# EAGLE schematic ActuatorBoard (EAGLE 9.6.2)

## Sheet 1 of 8
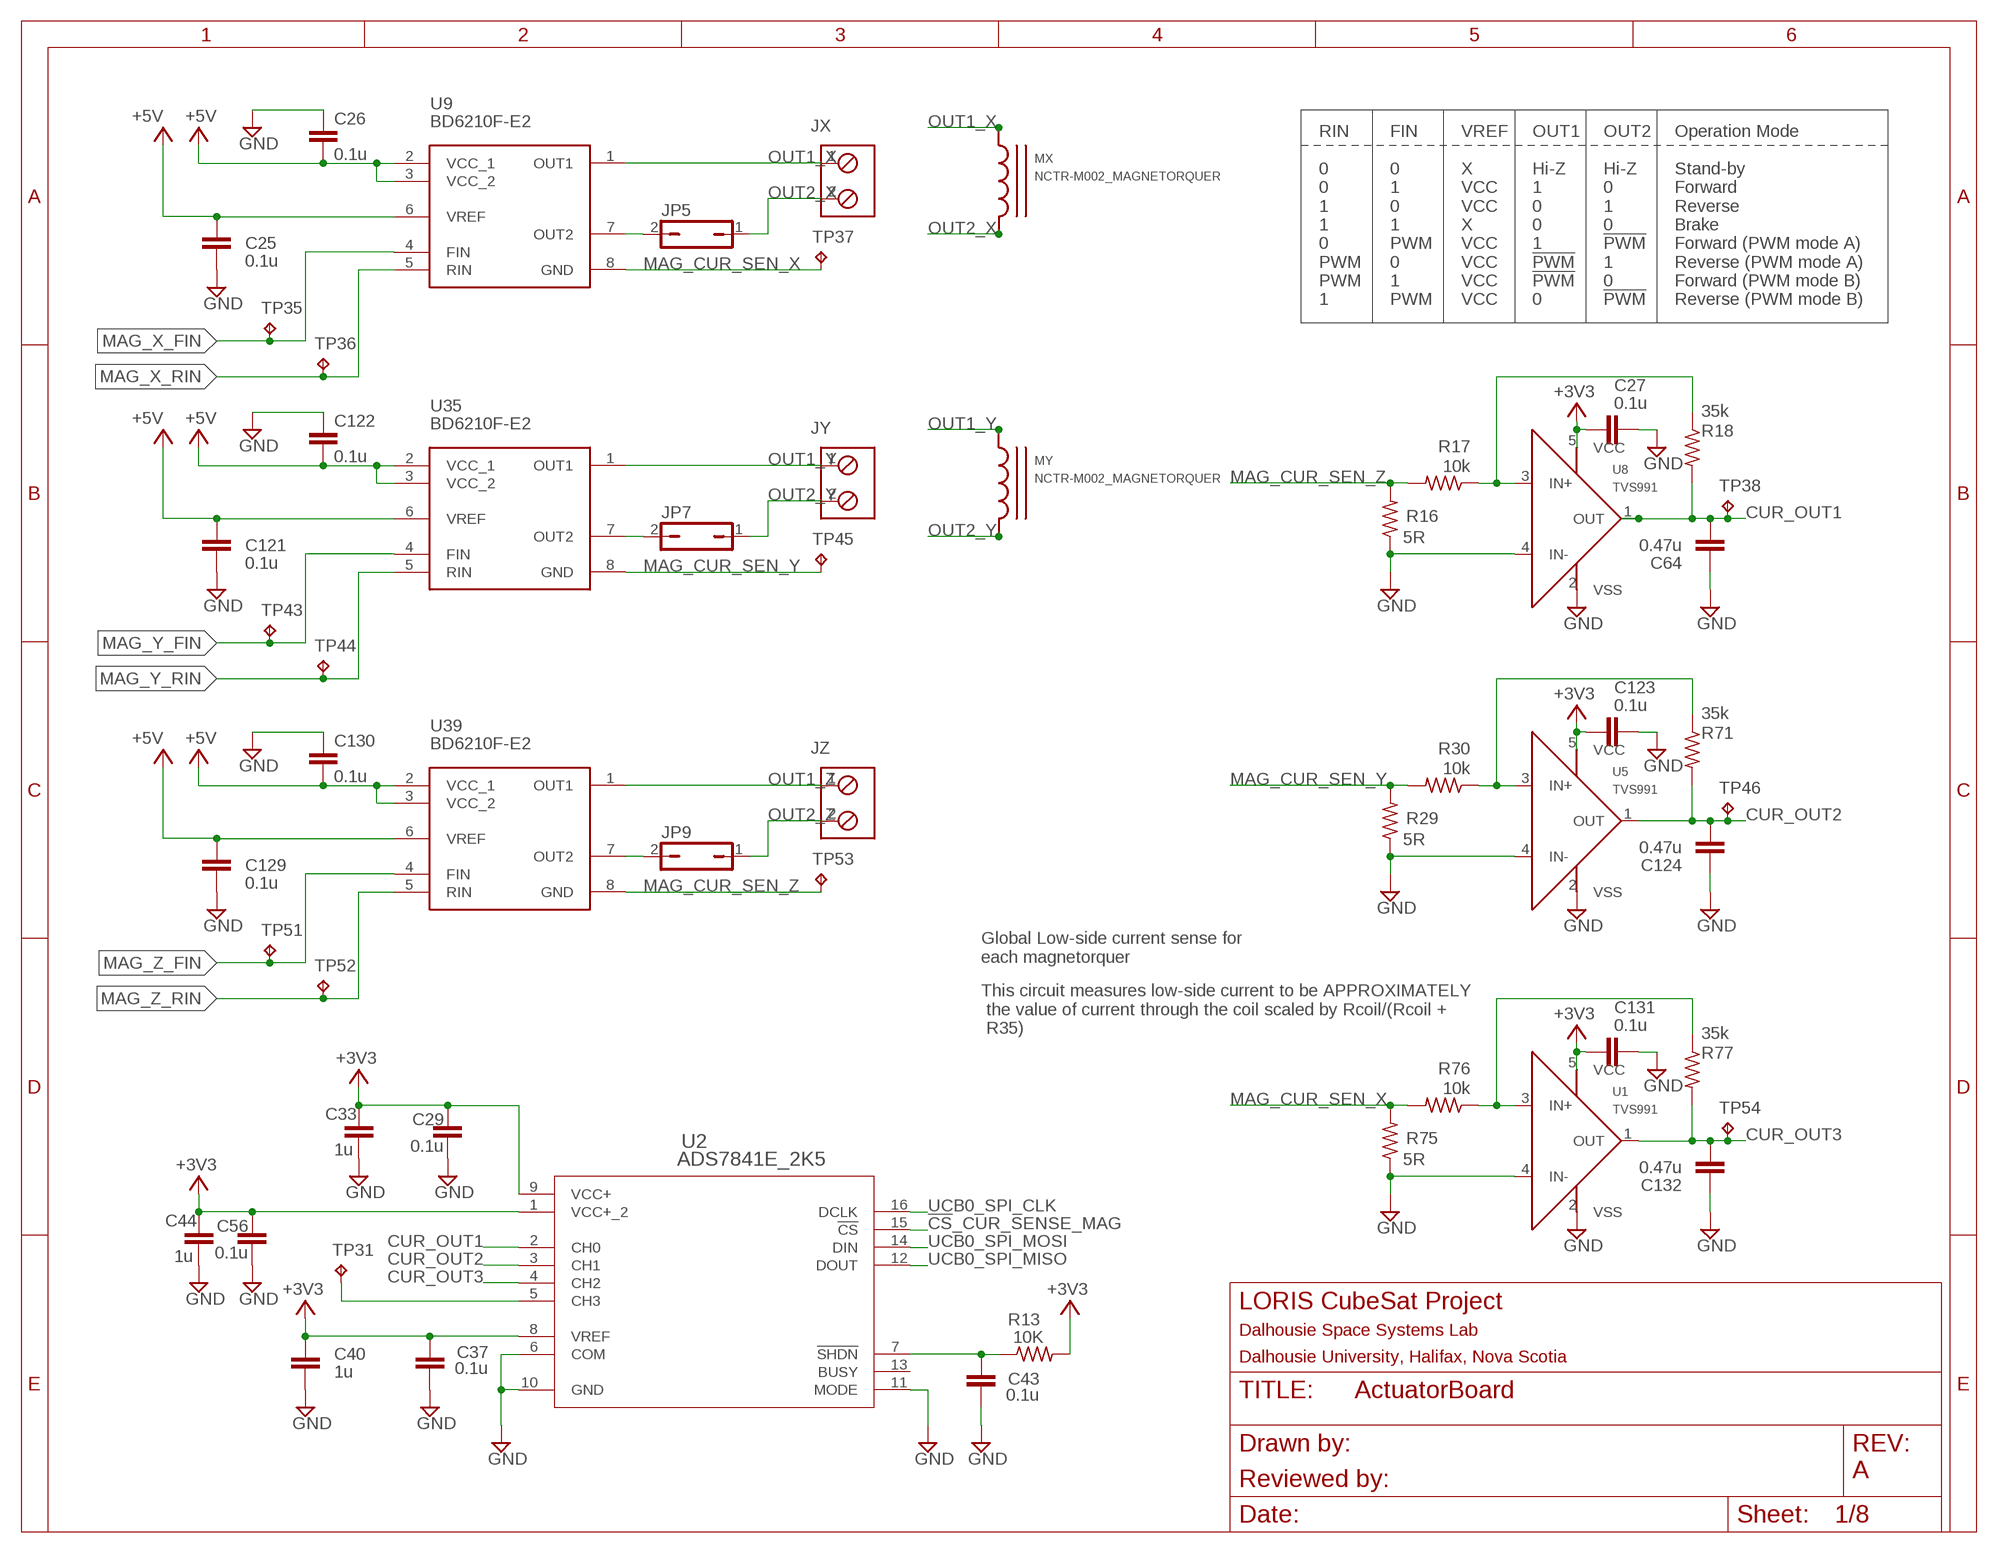
[diagram p0: schematic, sheet 1]

### Parts
C25  0.1u  C-EUC0603  [C0603]
C26  0.1u  C-EUC0603  [C0603]
C27  0.1u  C-EUC0402  [C0402]
C29  0.1u  C-EUC0402  [C0402]
C33  1u  C-EUC0402  [C0402]
C37  0.1u  C-EUC0402  [C0402]
C40  1u  C-EUC0402  [C0402]
C43  0.1u  C-EUC0402  [C0402]
C44  1u  C-EUC0402  [C0402]
C56  0.1u  C-EUC0402  [C0402]
C64  0.47u  C-EUC0603  [C0603]
C121  0.1u  C-EUC0603  [C0603]
C122  0.1u  C-EUC0603  [C0603]
C123  0.1u  C-EUC0402  [C0402]
C124  0.47u  C-EUC0603  [C0603]
C129  0.1u  C-EUC0603  [C0603]
C130  0.1u  C-EUC0603  [C0603]
C131  0.1u  C-EUC0402  [C0402]
C132  0.47u  C-EUC0603  [C0603]
JP5  JP1Q_  [1X02]
JP7  JP1Q_  [1X02]
JP9  JP1Q_  [1X02]
JX  TRM_BLK_1X2  [2POL254]
JY  TRM_BLK_1X2  [2POL254]
JZ  TRM_BLK_1X2  [2POL254]
MX  NCTR-M002_MAGNETORQUER  [MAG_MOUNT_V3]
MY  NCTR-M002_MAGNETORQUER  [MAG_MOUNT_V3]
R13  10K  R-US_R0402  [R0402]
R16  5R  R-US_R0402  [R0402]
R17  10k  R-US_R0402  [R0402]
R18  35k  R-US_R0402  [R0402]
R29  5R  R-US_R0402  [R0402]
R30  10k  R-US_R0402  [R0402]
R71  35k  R-US_R0402  [R0402]
R75  5R  R-US_R0402  [R0402]
R76  10k  R-US_R0402  [R0402]
R77  35k  R-US_R0402  [R0402]
TP31  TESTPOINT  [TP_P76H50]
TP35  TESTPOINT  [TP_P76H50]
TP36  TESTPOINT  [TP_P76H50]
TP37  TESTPOINT  [TP_P76H50]
TP38  TESTPOINT  [TP_P76H50]
TP43  TESTPOINT  [TP_P76H50]
TP44  TESTPOINT  [TP_P76H50]
TP45  TESTPOINT  [TP_P76H50]
TP46  TESTPOINT  [TP_P76H50]
TP51  TESTPOINT  [TP_P76H50]
TP52  TESTPOINT  [TP_P76H50]
TP53  TESTPOINT  [TP_P76H50]
TP54  TESTPOINT  [TP_P76H50]
U1  TVS991  [SOT95P280X145-5N]
U2  ADS7841E_2K5  [DBQ16]
U5  TVS991  [SOT95P280X145-5N]
U8  TVS991  [SOT95P280X145-5N]
U9  BD6210F-E2  [BD6221F-E2_SOIC8P127_500X620X171L30X42N]
U35  BD6210F-E2  [BD6221F-E2_SOIC8P127_500X620X171L30X42N]
U39  BD6210F-E2  [BD6221F-E2_SOIC8P127_500X620X171L30X42N]

### Nets
!CS!_CUR_SENSE_MAG: U2.15(!CS) ; also sheet 2
+3V3: C27.1 C29.1 C33.1 C37.1 C40.1 C44.1 C56.1 C123.1 C131.1 R13.2 U1.5(VCC) U2.1(VCC+_2) U2.8(VREF) U2.9(VCC+) U5.5(VCC) U8.5(VCC) ; also sheet 2,3,4,5,6,7,8
+5V: C25.1 C26.2 C121.1 C122.2 C129.1 C130.2 U9.2(VCC_1) U9.3(VCC_2) U9.6(VREF) U35.2(VCC_1) U35.3(VCC_2) U35.6(VREF) U39.2(VCC_1) U39.3(VCC_2) U39.6(VREF) ; also sheet 2,7,8
CUR_OUT1: C64.2 R18.2 TP38.1(TP) U2.2(CH0) U8.1(OUT)
CUR_OUT2: C124.2 R71.2 TP46.1(TP) U2.3(CH1) U5.1(OUT)
CUR_OUT3: C132.2 R77.2 TP54.1(TP) U1.1(OUT) U2.4(CH2)
GND: C25.2 C26.1 C27.2 C29.2 C33.2 C37.2 C40.2 C43.2 C44.2 C56.2 C64.1 C121.2 C122.1 C123.2 C124.1 C129.2 C130.1 C131.2 C132.1 R16.1 R29.1 R75.1 U1.2(VSS) U1.4(IN-) U2.6(COM) U2.10(GND) U2.11(MODE) U5.2(VSS) U5.4(IN-) U8.2(VSS) U8.4(IN-) ; also sheet 2,3,4,5,6,7,8
MAG_CUR_SEN_X: R75.2 R76.2 TP37.1(TP) U9.8(GND)
MAG_CUR_SEN_Y: R29.2 R30.2 TP45.1(TP) U35.8(GND)
MAG_CUR_SEN_Z: R16.2 R17.2 TP53.1(TP) U39.8(GND)
MAG_X_FIN: TP35.1(TP) U9.4(FIN) ; also sheet 2
MAG_X_RIN: TP36.1(TP) U9.5(RIN) ; also sheet 2
MAG_Y_FIN: TP43.1(TP) U35.4(FIN) ; also sheet 2
MAG_Y_RIN: TP44.1(TP) U35.5(RIN) ; also sheet 2
MAG_Z_FIN: TP51.1(TP) U39.4(FIN) ; also sheet 2
MAG_Z_RIN: TP52.1(TP) U39.5(RIN) ; also sheet 2
N$13: C43.1 R13.1 U2.7(!SHDN)
N$15: TP31.1(TP) U2.5(CH3)
N$16: JP5.2 U9.7(OUT2)
N$21: R17.1 R18.1 U8.3(IN+)
N$33: JP7.2 U35.7(OUT2)
N$48: R30.1 R71.1 U5.3(IN+)
N$67: JP9.2 U39.7(OUT2)
N$68: R76.1 R77.1 U1.3(IN+)
OUT1_X: JX.1 U9.1(OUT1)
OUT1_Y: JY.1 U35.1(OUT1)
OUT1_Z: JZ.1 U39.1(OUT1)
OUT2_X: JP5.1 JX.2
OUT2_Y: JP7.1 JY.2
OUT2_Z: JP9.1 JZ.2
UCB0_SPI_CLK: U2.16(DCLK) ; also sheet 2,3,4,5,6,7
UCB0_SPI_MISO: U2.12(DOUT) ; also sheet 2,3,4,5,6,7
UCB0_SPI_MOSI: U2.14(DIN) ; also sheet 2,3,4,5,6,7
Unconnected: U2.13(BUSY)

### Notes on the sheet
- RIN
  
  0
  0
  1
  1
  0
  PWM
  PWM
  1
- FIN
  
  0
  1
  0
  1
  PWM
  0
  1
  PWM
- VREF
  
  X
  VCC
  VCC
  X
  VCC
  VCC
  VCC
  VCC
- OUT1
  
  Hi-Z
  1
  0
  0
  1
  !PWM
  !PWM
  0
- OUT2
  
  Hi-Z
  0
  1
  0
  !PWM
  1
  0
  !PWM
- Operation Mode
  
  Stand-by
  Forward
  Reverse
  Brake
  Forward (PWM mode A)
  Reverse (PWM mode A)
  Forward (PWM mode B)
  Reverse (PWM mode B)
- Global Low-side current sense for
  each magnetorquer
- This circuit measures low-side current to be APPROXIMATELY
   the value of current through the coil scaled by Rcoil/(Rcoil +
   R35)
- A

## Sheet 2 of 8
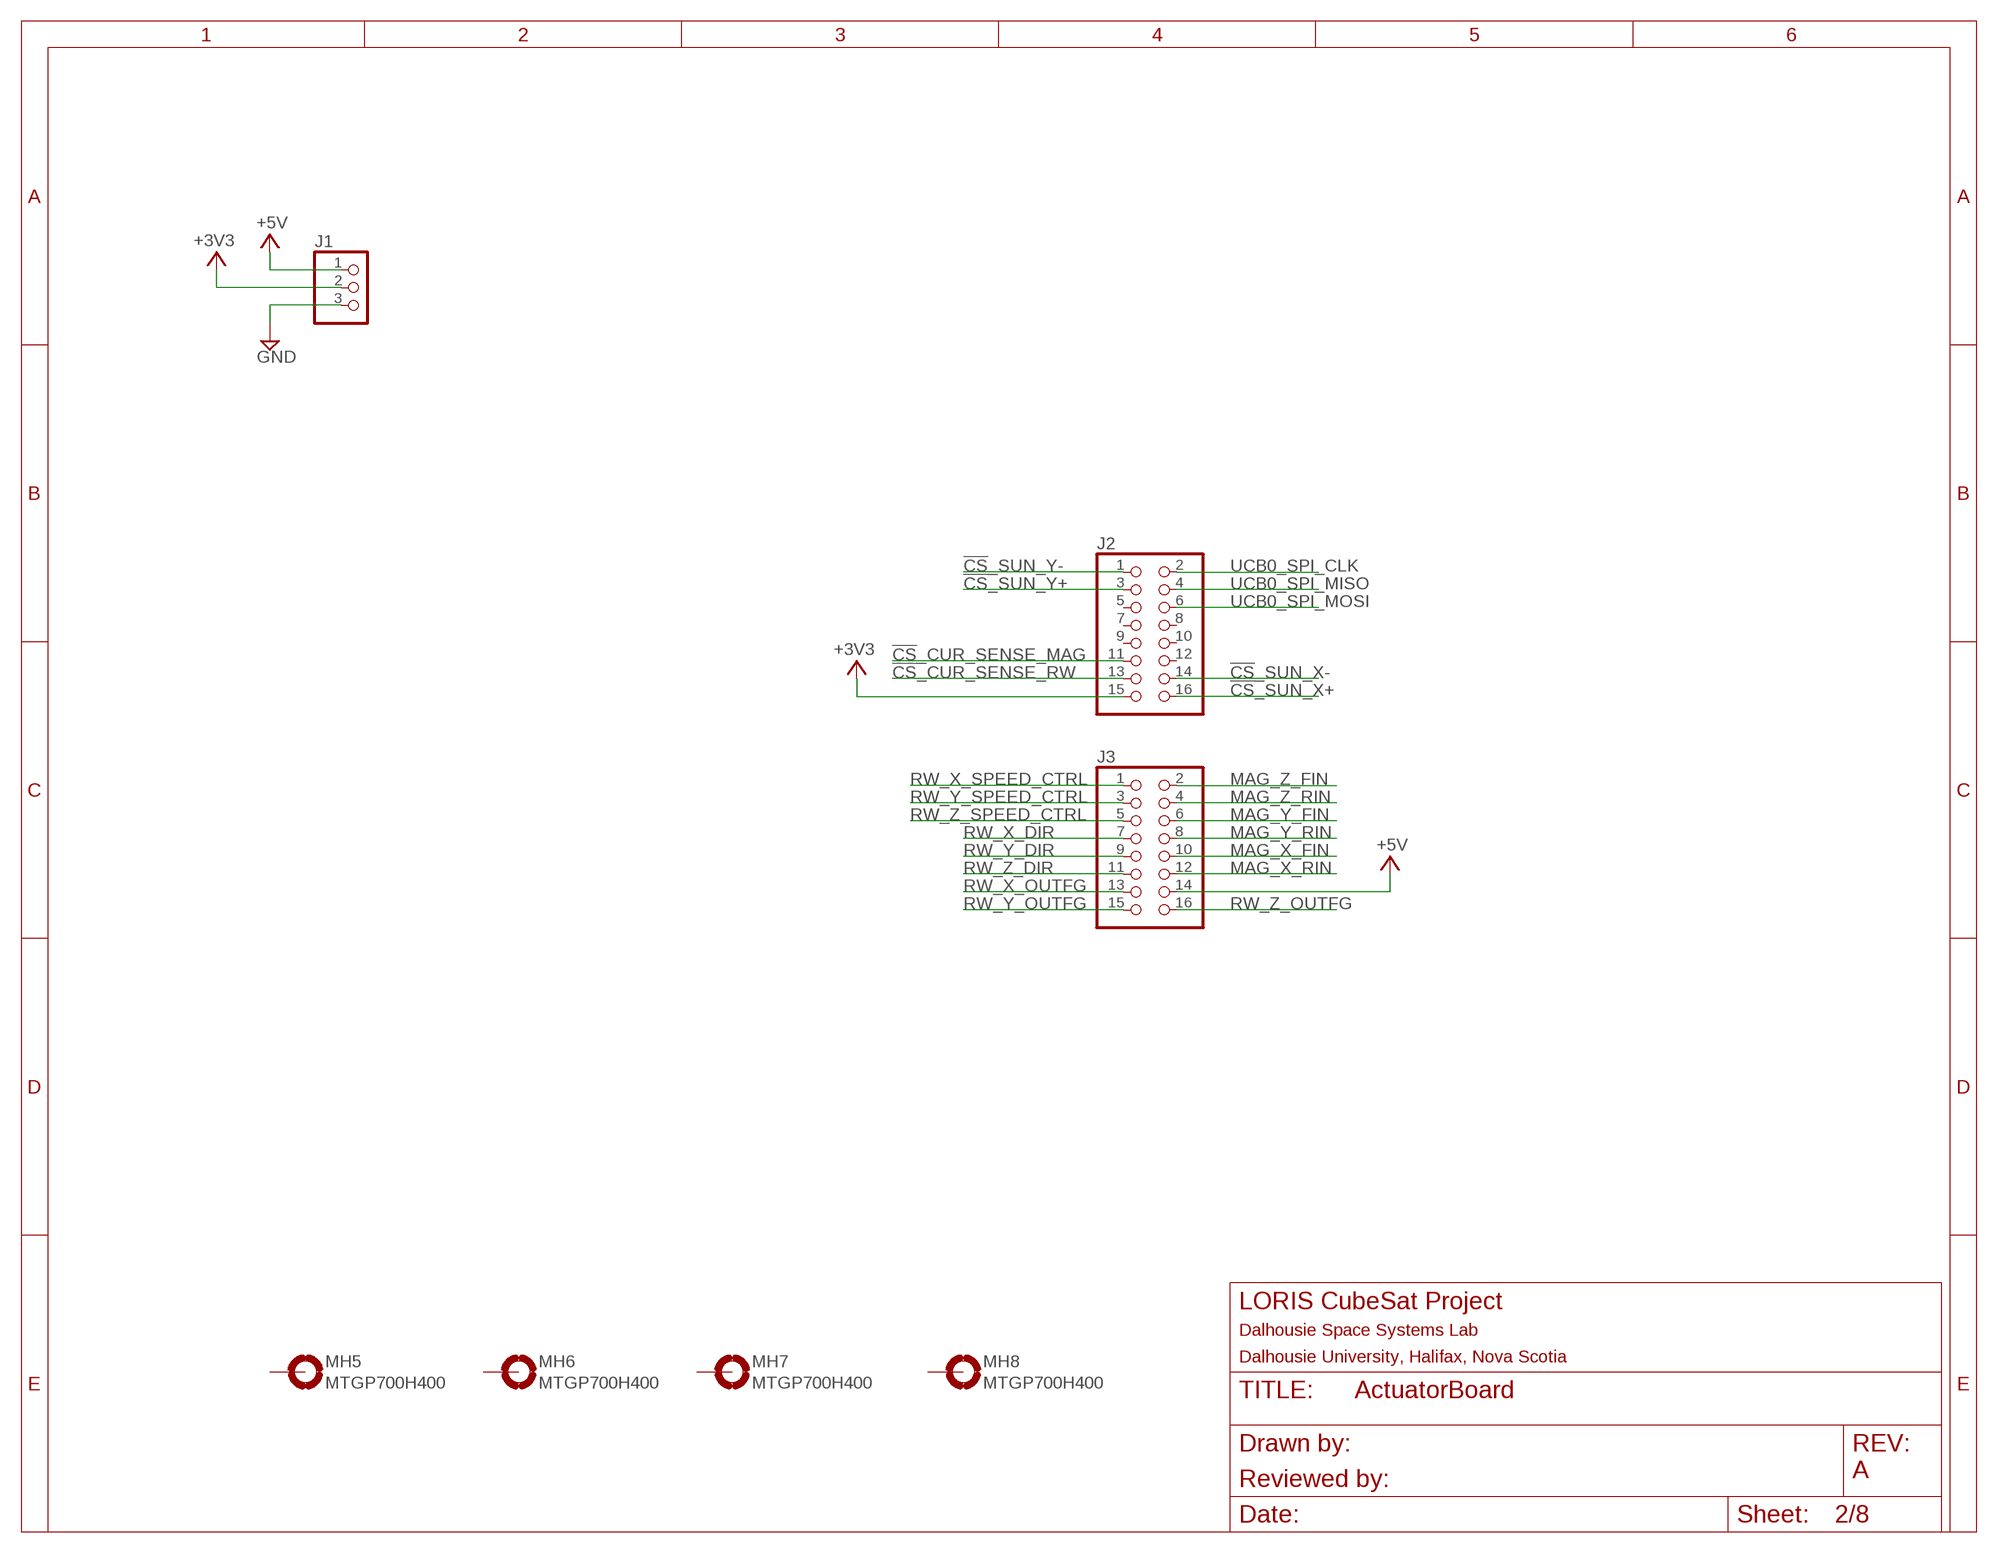
[diagram p1: schematic, sheet 2]

### Parts
J1  PINHD-1X3  [1X03]
J2  PINHD-2X8_TXT-MOVED  [2X08_TXT-MOVED]
J3  PINHD-2X8_TXT-MOVED  [2X08_TXT-MOVED]
MH5  MTGP700H400  [MTGP700H400]
MH6  MTGP700H400  [MTGP700H400]
MH7  MTGP700H400  [MTGP700H400]
MH8  MTGP700H400  [MTGP700H400]

### Nets
!CS!_CUR_SENSE_MAG: J2.11 ; also sheet 1
!CS!_CUR_SENSE_RW: J2.13 ; also sheet 7
!CS!_SUN_X+: J2.16 ; also sheet 3
!CS!_SUN_X-: J2.14 ; also sheet 4
!CS!_SUN_Y+: J2.3 ; also sheet 5
!CS!_SUN_Y-: J2.1 ; also sheet 6
+3V3: J1.2 J2.15 ; also sheet 1,3,4,5,6,7,8
+5V: J1.1 J3.14 ; also sheet 1,7,8
GND: J1.3 ; also sheet 1,3,4,5,6,7,8
MAG_X_FIN: J3.10 ; also sheet 1
MAG_X_RIN: J3.12 ; also sheet 1
MAG_Y_FIN: J3.6 ; also sheet 1
MAG_Y_RIN: J3.8 ; also sheet 1
MAG_Z_FIN: J3.2 ; also sheet 1
MAG_Z_RIN: J3.4 ; also sheet 1
RW_X_DIR: J3.7 ; also sheet 8
RW_X_OUTFG: J3.13 ; also sheet 8
RW_X_SPEED_CTRL: J3.1 ; also sheet 8
RW_Y_DIR: J3.9 ; also sheet 7
RW_Y_OUTFG: J3.15 ; also sheet 7
RW_Y_SPEED_CTRL: J3.3 ; also sheet 7
RW_Z_DIR: J3.11 ; also sheet 8
RW_Z_OUTFG: J3.16 ; also sheet 8
RW_Z_SPEED_CTRL: J3.5 ; also sheet 8
UCB0_SPI_CLK: J2.2 ; also sheet 1,3,4,5,6,7
UCB0_SPI_MISO: J2.4 ; also sheet 1,3,4,5,6,7
UCB0_SPI_MOSI: J2.6 ; also sheet 1,3,4,5,6,7
Unconnected: J2.5 J2.7 J2.8 J2.9 J2.10 J2.12 MH5.1(MOUNT) MH6.1(MOUNT) MH7.1(MOUNT) MH8.1(MOUNT)

### Notes on the sheet
- A

## Sheet 3 of 8
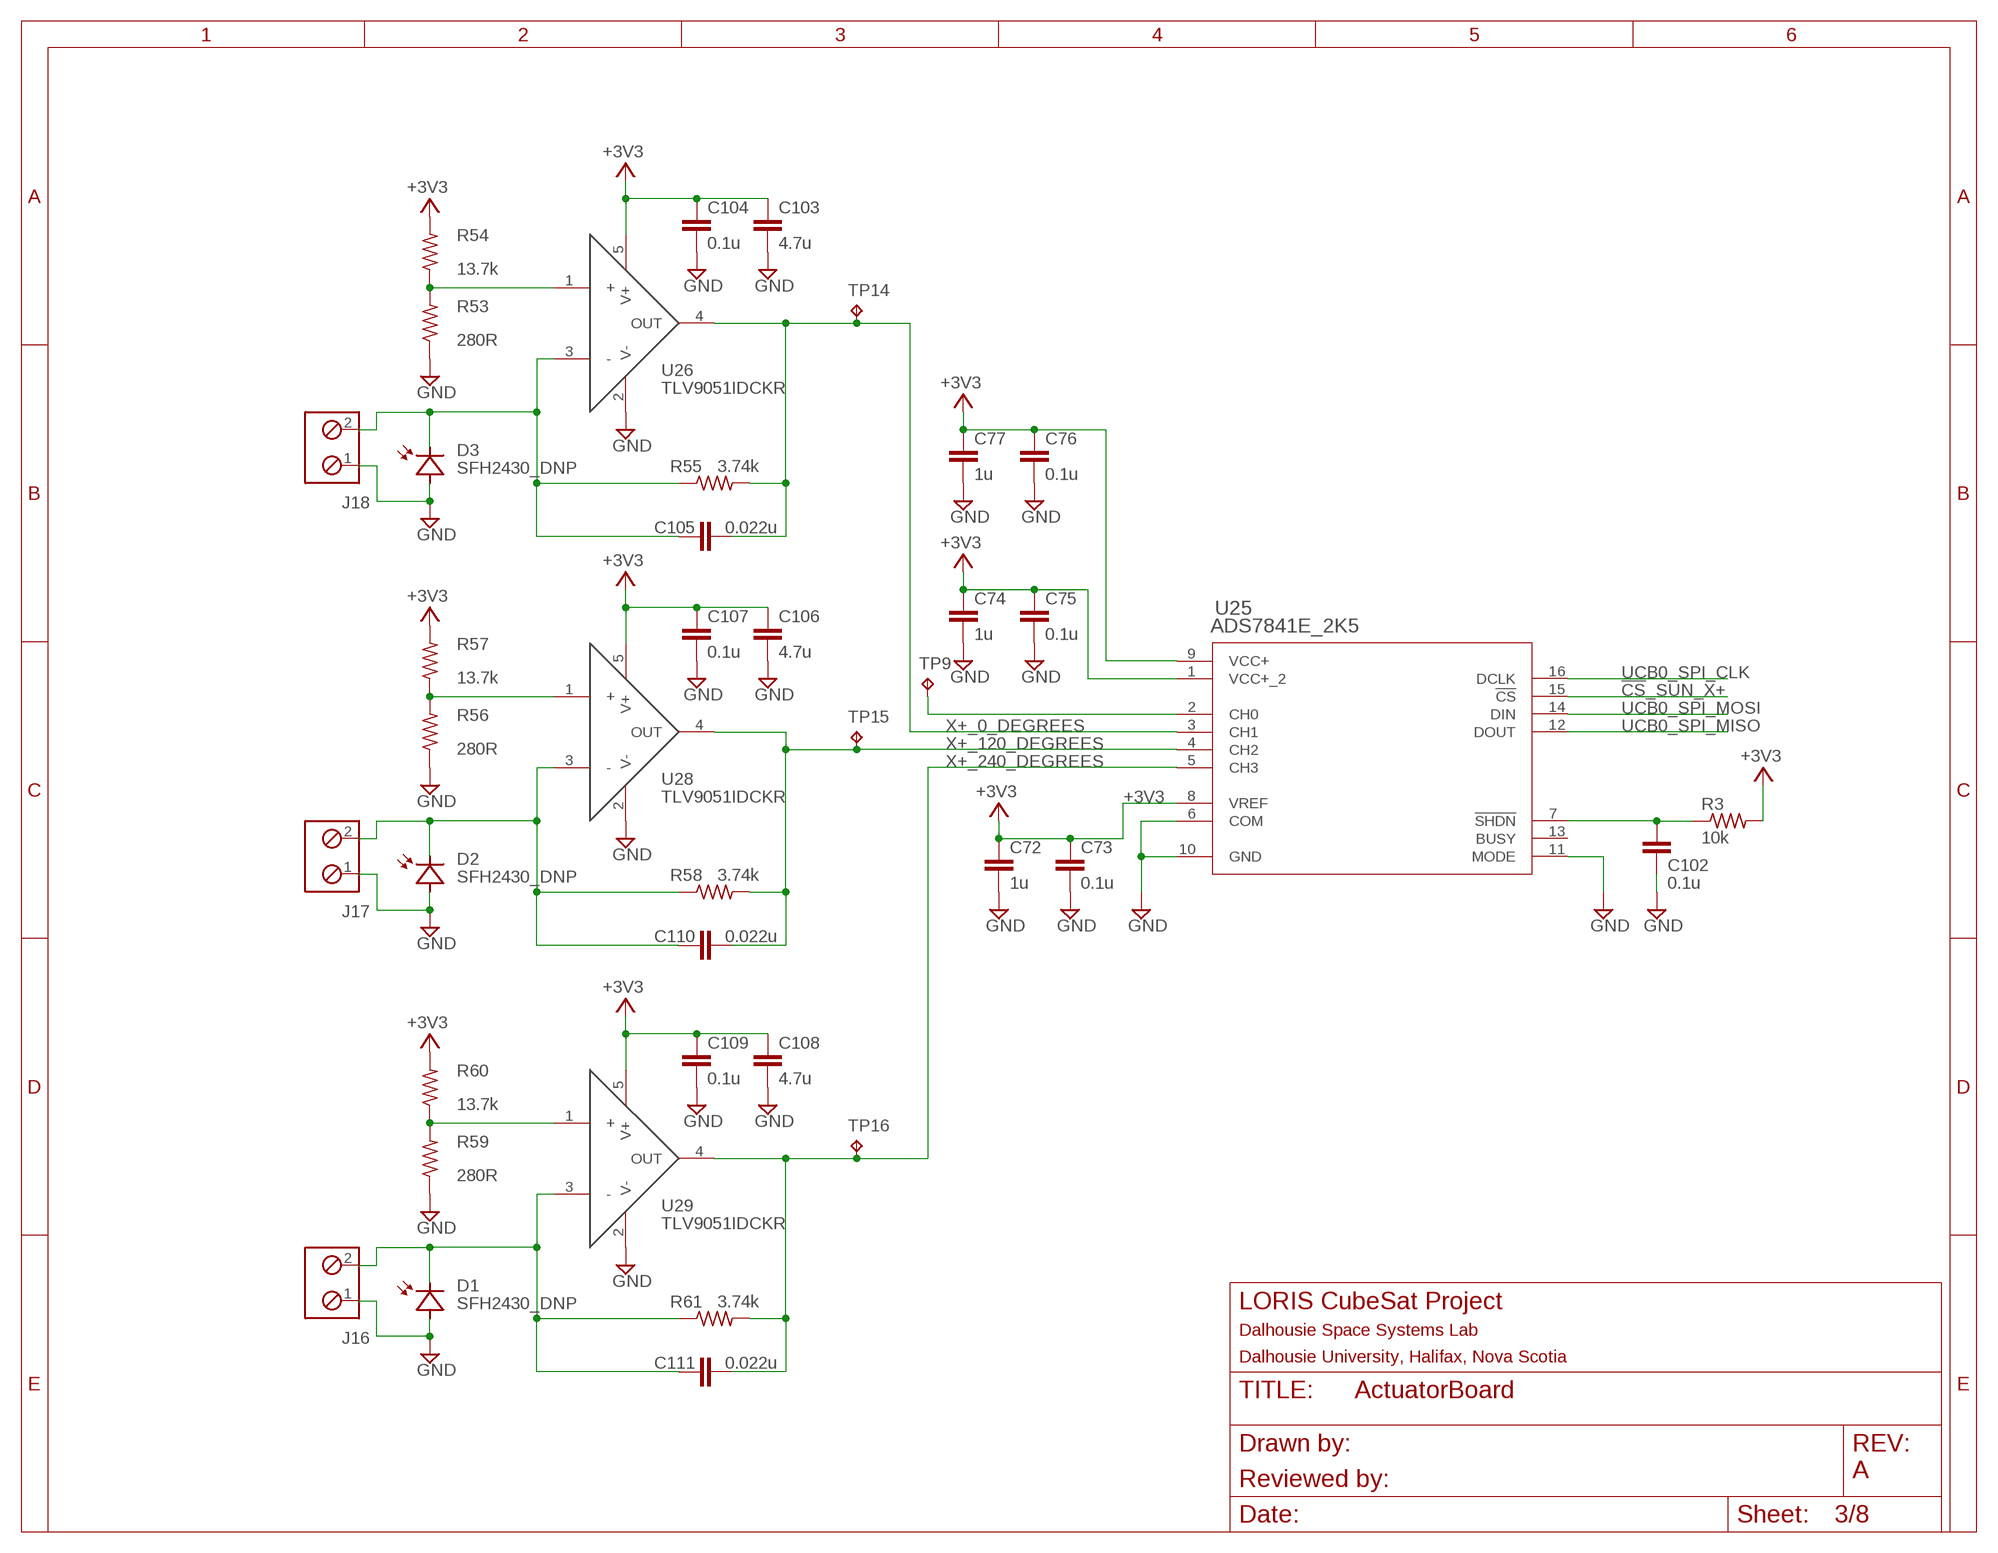
[diagram p2: schematic, sheet 3]

### Parts
C72  1u  C-EUC0402  [C0402]
C73  0.1u  C-EUC0402  [C0402]
C74  1u  C-EUC0402  [C0402]
C75  0.1u  C-EUC0402  [C0402]
C76  0.1u  C-EUC0402  [C0402]
C77  1u  C-EUC0402  [C0402]
C102  0.1u  C-EUC0402  [C0402]
C103  4.7u  C-EUC0402  [C0402]
C104  0.1u  C-EUC0402  [C0402]
C105  0.022u  C-EUC0402  [C0402]
C106  4.7u  C-EUC0402  [C0402]
C107  0.1u  C-EUC0402  [C0402]
C108  4.7u  C-EUC0402  [C0402]
C109  0.1u  C-EUC0402  [C0402]
C110  0.022u  C-EUC0402  [C0402]
C111  0.022u  C-EUC0402  [C0402]
J16  TRM_BLK_1X2  [2POL254]
J17  TRM_BLK_1X2  [2POL254]
J18  TRM_BLK_1X2  [2POL254]
R3  10k  R-US_R0402  [R0402]
R53  280R  R-US_R0402  [R0402]
R54  13.7k  R-US_R0402  [R0402]
R55  3.74k  R-US_R0402  [R0402]
R56  280R  R-US_R0402  [R0402]
R57  13.7k  R-US_R0402  [R0402]
R58  3.74k  R-US_R0402  [R0402]
R59  280R  R-US_R0402  [R0402]
R60  13.7k  R-US_R0402  [R0402]
R61  3.74k  R-US_R0402  [R0402]
TP9  TESTPOINT  [TP_P76H50]
TP14  TESTPOINT  [TP_P76H50]
TP15  TESTPOINT  [TP_P76H50]
TP16  TESTPOINT  [TP_P76H50]
U25  ADS7841E_2K5  [DBQ16]
U26  TLV9051IDCKR  [SC70-5P65_210X110L36X22N_TLV9051]
U28  TLV9051IDCKR  [SC70-5P65_210X110L36X22N_TLV9051]
U29  TLV9051IDCKR  [SC70-5P65_210X110L36X22N_TLV9051]

### Nets
!CS!_SUN_X+: U25.15(!CS) ; also sheet 2
+3V3: C72.1 C73.1 C74.1 C75.1 C76.1 C77.1 C103.1 C104.1 C106.1 C107.1 C108.1 C109.1 R3.2 R54.2 R57.2 R60.2 U25.1(VCC+_2) U25.8(VREF) U25.9(VCC+) U26.5(V+) U28.5(V+) U29.5(V+) ; also sheet 1,2,4,5,6,7,8
GND: C72.2 C73.2 C74.2 C75.2 C76.2 C77.2 C102.2 C103.2 C104.2 C106.2 C107.2 C108.2 C109.2 J16.1 J17.1 J18.1 R53.1 R56.1 R59.1 U25.6(COM) U25.10(GND) U25.11(MODE) U26.2(V-) U28.2(V-) U29.2(V-) ; also sheet 1,2,4,5,6,7,8
N$2: TP9.1(TP) U25.2(CH0)
N$4: C102.1 R3.1 U25.7(!SHDN)
N$49: C105.1 J18.2 R55.1 U26.3(-)
N$54: R53.2 R54.1 U26.1(+)
N$55: C110.1 J17.2 R58.1 U28.3(-)
N$56: R56.2 R57.1 U28.1(+)
N$57: C111.1 J16.2 R61.1 U29.3(-)
N$58: R59.2 R60.1 U29.1(+)
UCB0_SPI_CLK: U25.16(DCLK) ; also sheet 1,2,4,5,6,7
UCB0_SPI_MISO: U25.12(DOUT) ; also sheet 1,2,4,5,6,7
UCB0_SPI_MOSI: U25.14(DIN) ; also sheet 1,2,4,5,6,7
X+_0_DEGREES: C105.2 R55.2 TP14.1(TP) U25.3(CH1) U26.4(OUT)
X+_120_DEGREES: C110.2 R58.2 TP15.1(TP) U25.4(CH2) U28.4(OUT)
X+_240_DEGREES: C111.2 R61.2 TP16.1(TP) U25.5(CH3) U29.4(OUT)
Unconnected: U25.13(BUSY)

### Notes on the sheet
- A

## Sheet 4 of 8
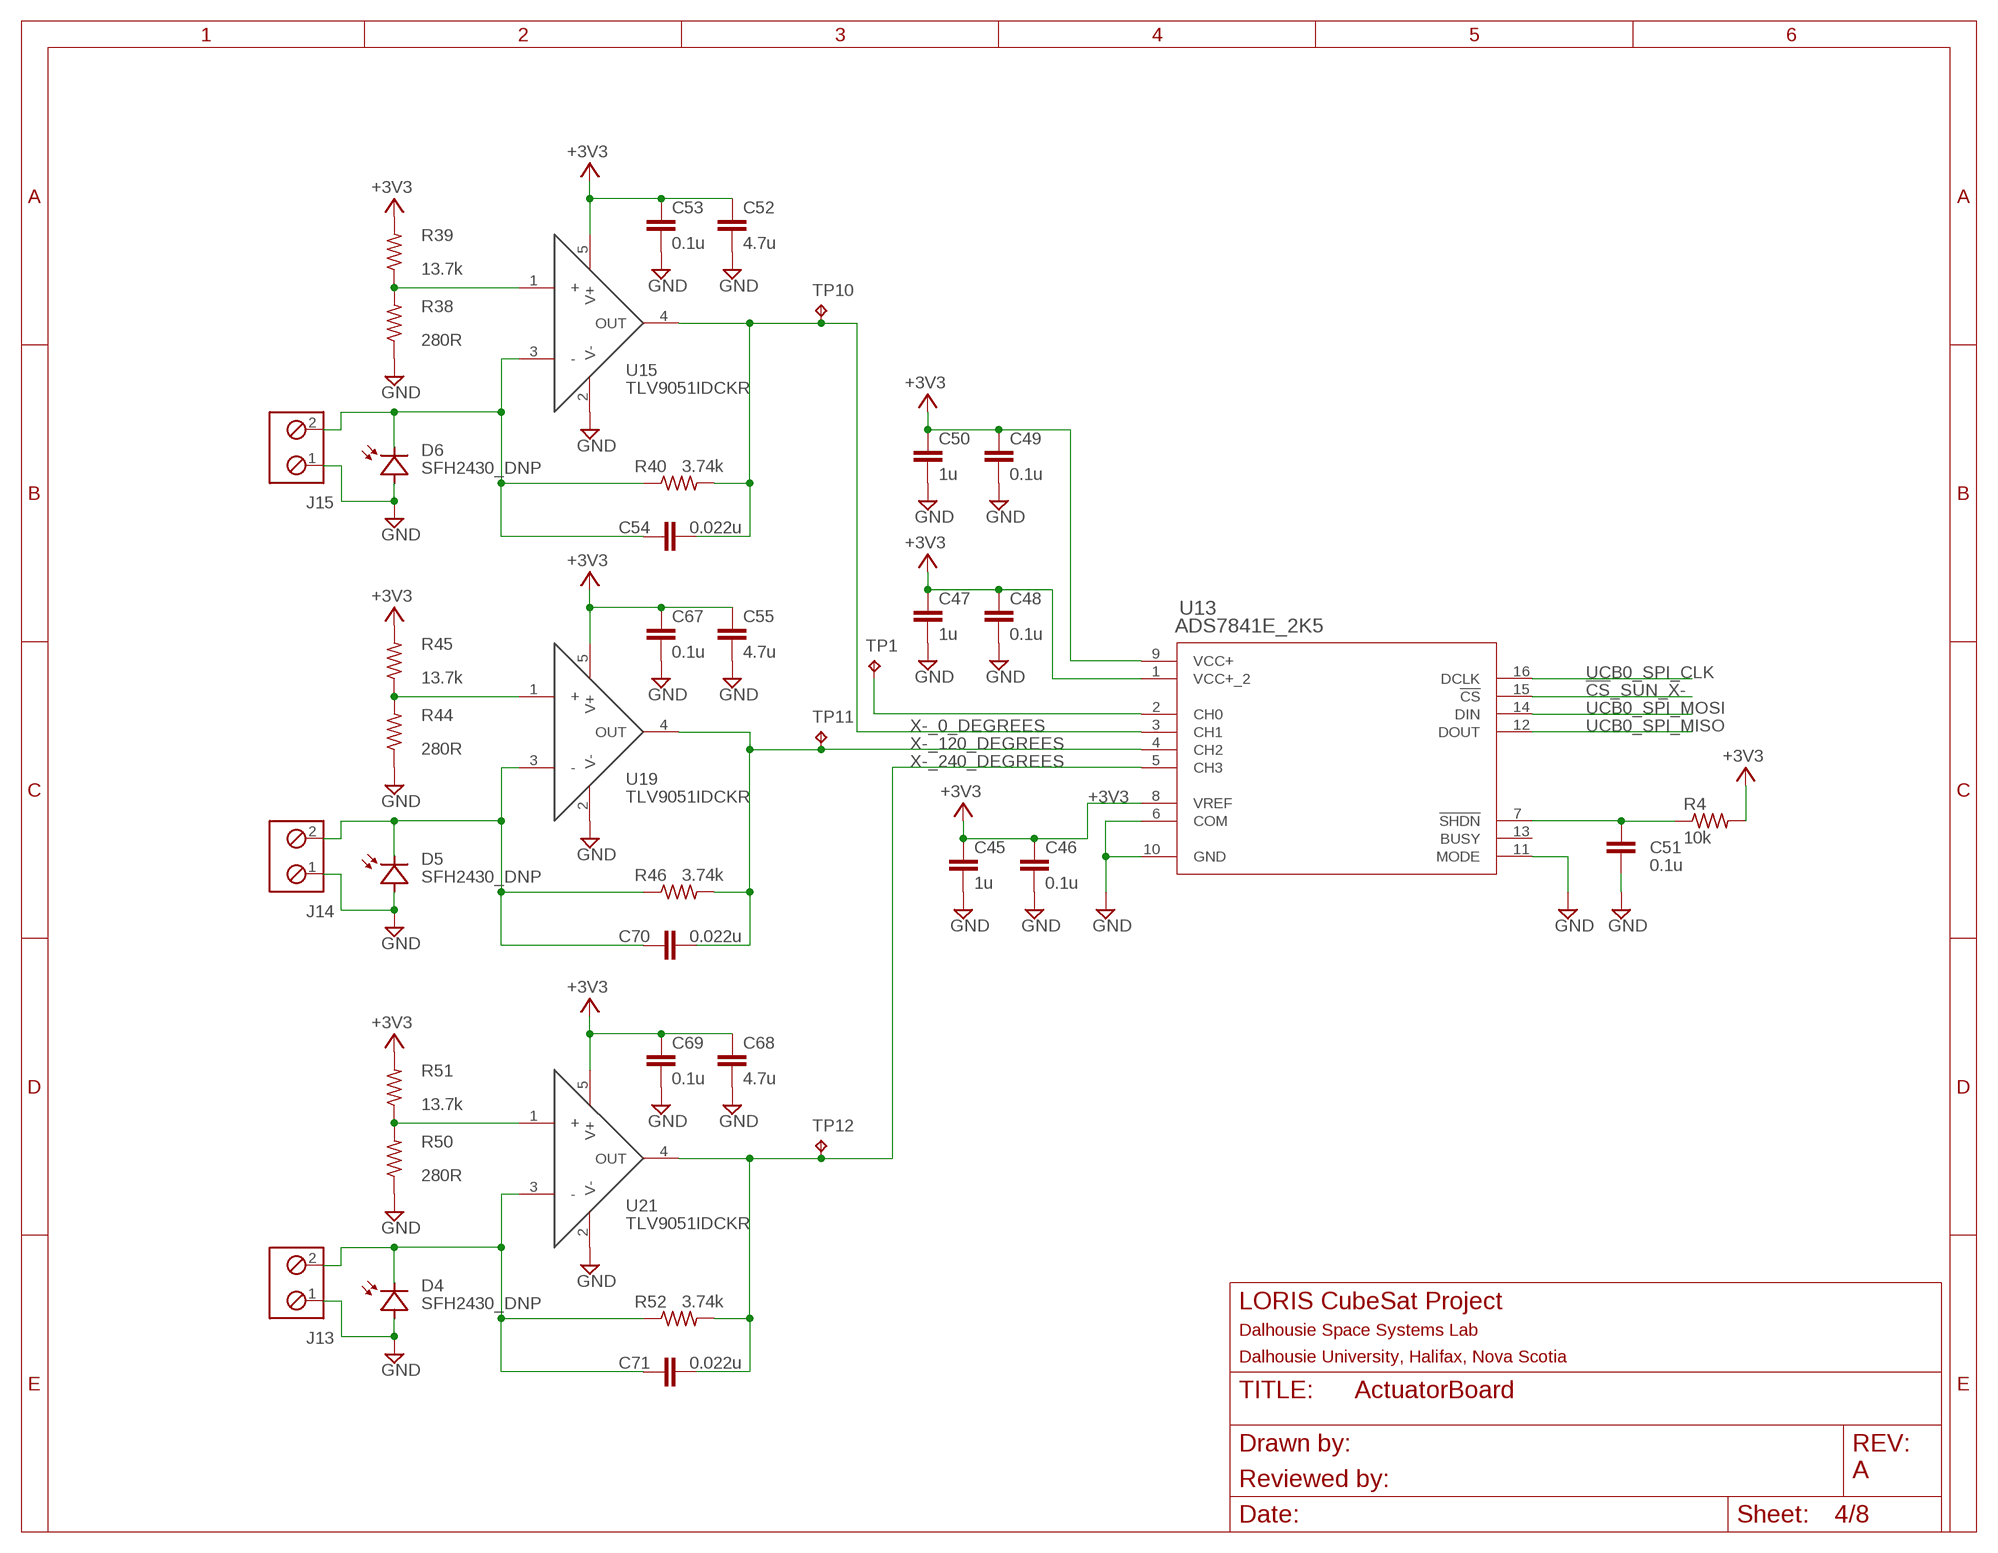
[diagram p3: schematic, sheet 4]

### Parts
C45  1u  C-EUC0402  [C0402]
C46  0.1u  C-EUC0402  [C0402]
C47  1u  C-EUC0402  [C0402]
C48  0.1u  C-EUC0402  [C0402]
C49  0.1u  C-EUC0402  [C0402]
C50  1u  C-EUC0402  [C0402]
C51  0.1u  C-EUC0402  [C0402]
C52  4.7u  C-EUC0402  [C0402]
C53  0.1u  C-EUC0402  [C0402]
C54  0.022u  C-EUC0402  [C0402]
C55  4.7u  C-EUC0402  [C0402]
C67  0.1u  C-EUC0402  [C0402]
C68  4.7u  C-EUC0402  [C0402]
C69  0.1u  C-EUC0402  [C0402]
C70  0.022u  C-EUC0402  [C0402]
C71  0.022u  C-EUC0402  [C0402]
J13  TRM_BLK_1X2  [2POL254]
J14  TRM_BLK_1X2  [2POL254]
J15  TRM_BLK_1X2  [2POL254]
R4  10k  R-US_R0402  [R0402]
R38  280R  R-US_R0402  [R0402]
R39  13.7k  R-US_R0402  [R0402]
R40  3.74k  R-US_R0402  [R0402]
R44  280R  R-US_R0402  [R0402]
R45  13.7k  R-US_R0402  [R0402]
R46  3.74k  R-US_R0402  [R0402]
R50  280R  R-US_R0402  [R0402]
R51  13.7k  R-US_R0402  [R0402]
R52  3.74k  R-US_R0402  [R0402]
TP1  TESTPOINT  [TP_P76H50]
TP10  TESTPOINT  [TP_P76H50]
TP11  TESTPOINT  [TP_P76H50]
TP12  TESTPOINT  [TP_P76H50]
U13  ADS7841E_2K5  [DBQ16]
U15  TLV9051IDCKR  [SC70-5P65_210X110L36X22N_TLV9051]
U19  TLV9051IDCKR  [SC70-5P65_210X110L36X22N_TLV9051]
U21  TLV9051IDCKR  [SC70-5P65_210X110L36X22N_TLV9051]

### Nets
!CS!_SUN_X-: U13.15(!CS) ; also sheet 2
+3V3: C45.1 C46.1 C47.1 C48.1 C49.1 C50.1 C52.1 C53.1 C55.1 C67.1 C68.1 C69.1 R4.2 R39.2 R45.2 R51.2 U13.1(VCC+_2) U13.8(VREF) U13.9(VCC+) U15.5(V+) U19.5(V+) U21.5(V+) ; also sheet 1,2,3,5,6,7,8
GND: C45.2 C46.2 C47.2 C48.2 C49.2 C50.2 C51.2 C52.2 C53.2 C55.2 C67.2 C68.2 C69.2 J13.1 J14.1 J15.1 R38.1 R44.1 R50.1 U13.6(COM) U13.10(GND) U13.11(MODE) U15.2(V-) U19.2(V-) U21.2(V-) ; also sheet 1,2,3,5,6,7,8
N$1: TP1.1(TP) U13.2(CH0)
N$22: C51.1 R4.1 U13.7(!SHDN)
N$38: C54.1 J15.2 R40.1 U15.3(-)
N$41: R38.2 R39.1 U15.1(+)
N$44: C70.1 J14.2 R46.1 U19.3(-)
N$45: R44.2 R45.1 U19.1(+)
N$46: C71.1 J13.2 R52.1 U21.3(-)
N$47: R50.2 R51.1 U21.1(+)
UCB0_SPI_CLK: U13.16(DCLK) ; also sheet 1,2,3,5,6,7
UCB0_SPI_MISO: U13.12(DOUT) ; also sheet 1,2,3,5,6,7
UCB0_SPI_MOSI: U13.14(DIN) ; also sheet 1,2,3,5,6,7
X-_0_DEGREES: C54.2 R40.2 TP10.1(TP) U13.3(CH1) U15.4(OUT)
X-_120_DEGREES: C70.2 R46.2 TP11.1(TP) U13.4(CH2) U19.4(OUT)
X-_240_DEGREES: C71.2 R52.2 TP12.1(TP) U13.5(CH3) U21.4(OUT)
Unconnected: U13.13(BUSY)

### Notes on the sheet
- A

## Sheet 5 of 8
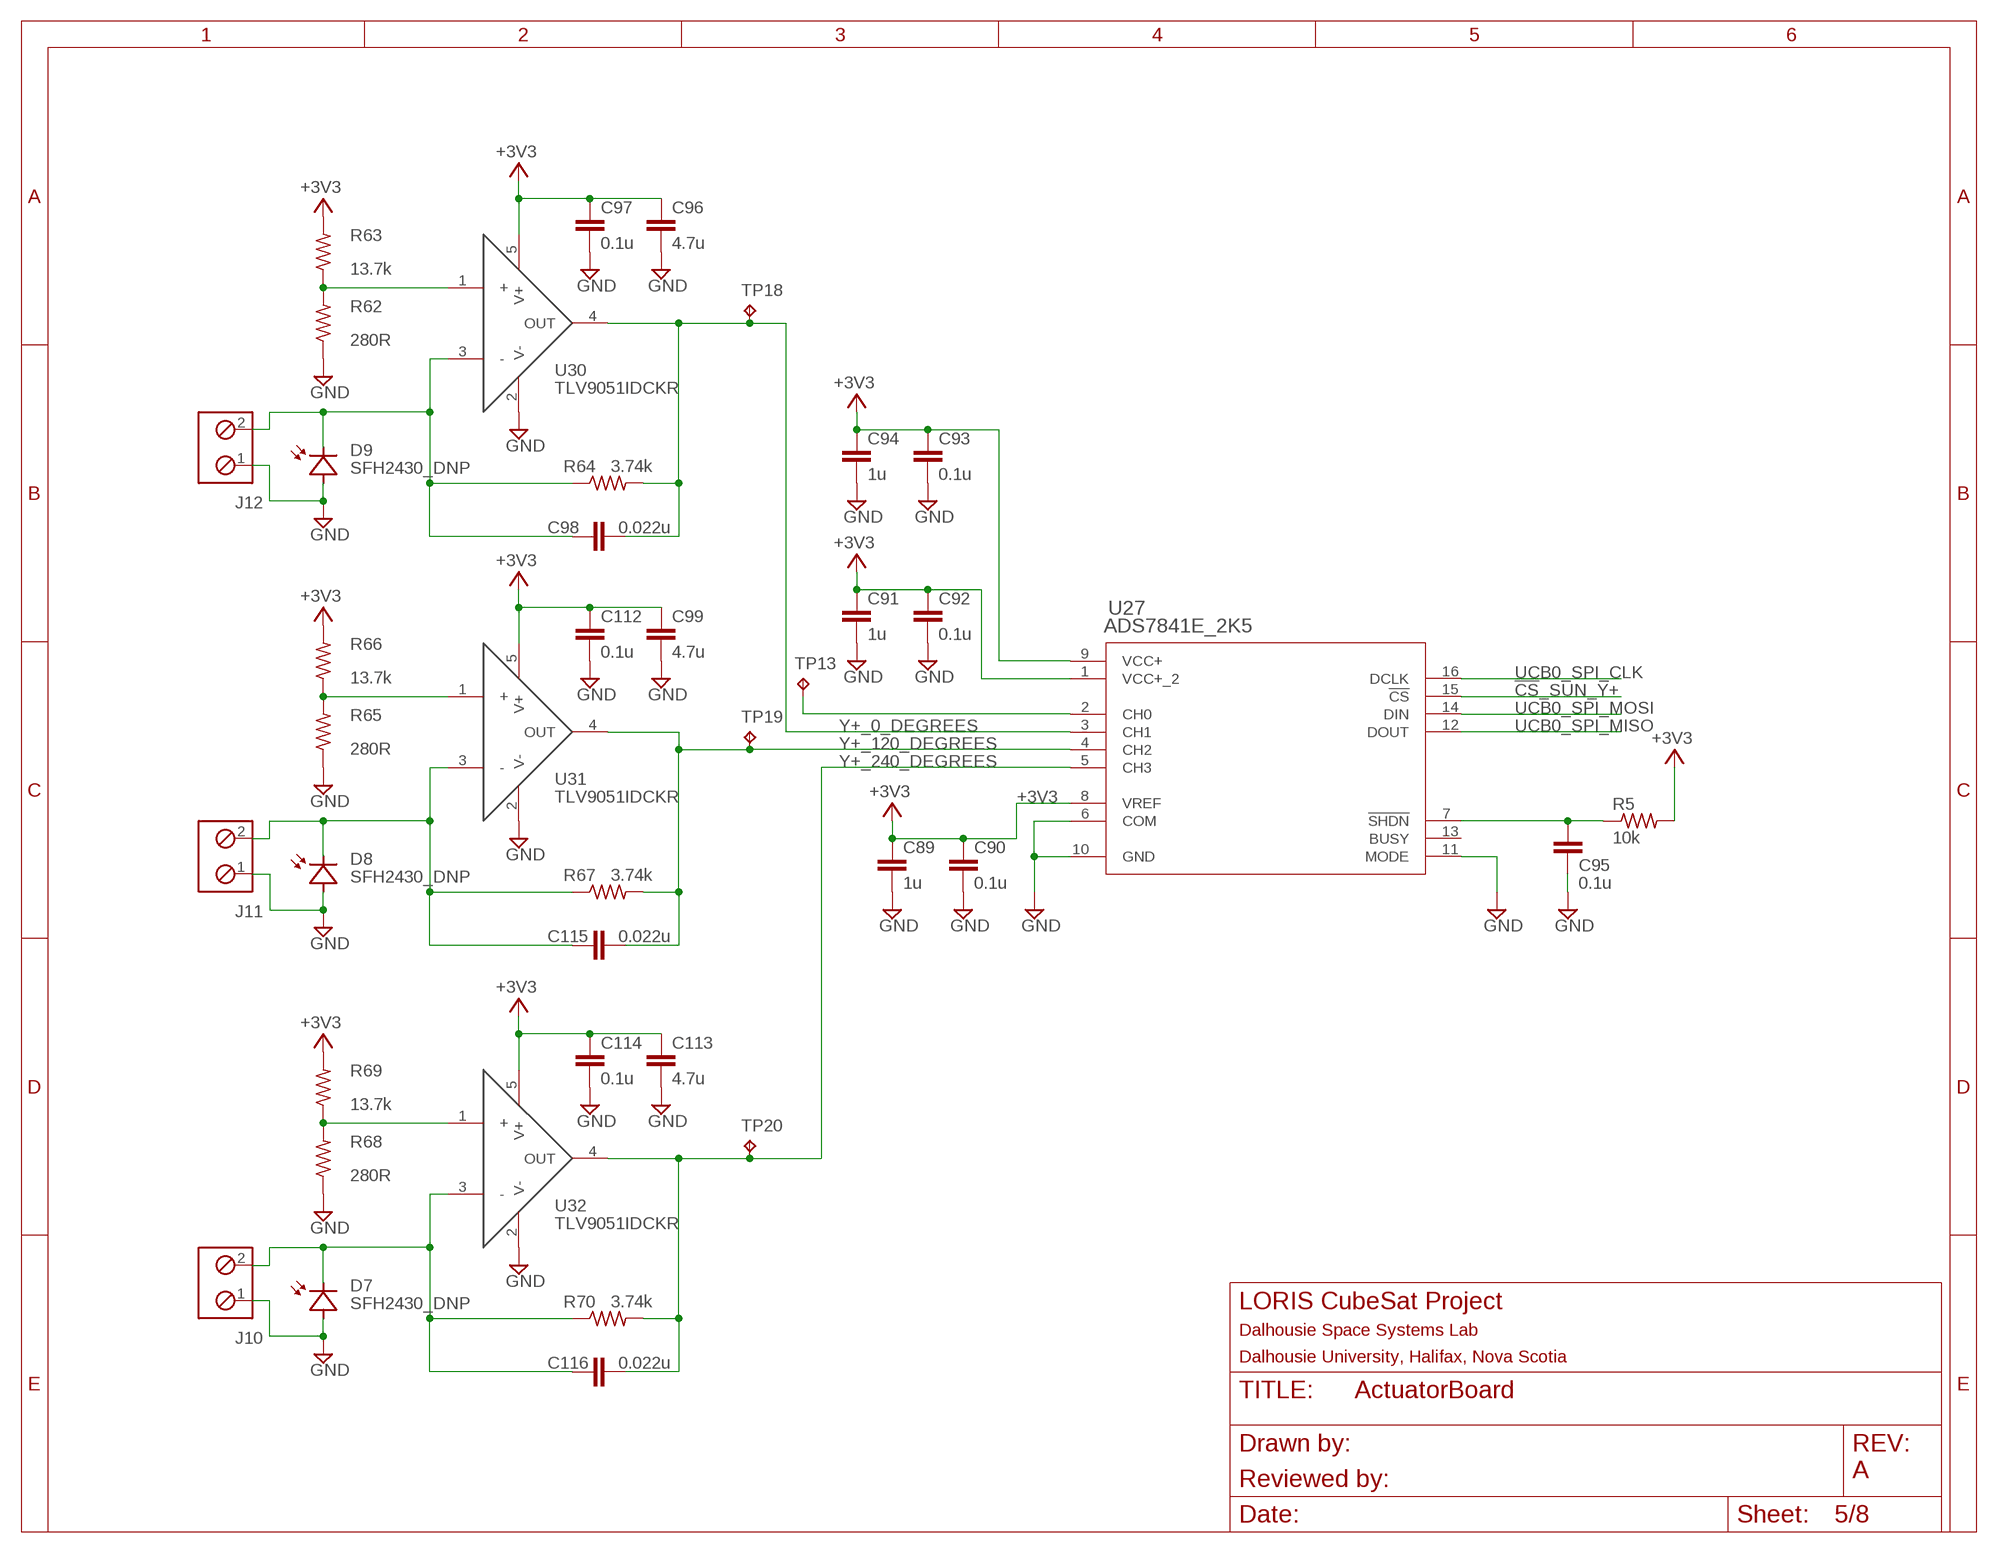
[diagram p4: schematic, sheet 5]

### Parts
C89  1u  C-EUC0402  [C0402]
C90  0.1u  C-EUC0402  [C0402]
C91  1u  C-EUC0402  [C0402]
C92  0.1u  C-EUC0402  [C0402]
C93  0.1u  C-EUC0402  [C0402]
C94  1u  C-EUC0402  [C0402]
C95  0.1u  C-EUC0402  [C0402]
C96  4.7u  C-EUC0402  [C0402]
C97  0.1u  C-EUC0402  [C0402]
C98  0.022u  C-EUC0402  [C0402]
C99  4.7u  C-EUC0402  [C0402]
C112  0.1u  C-EUC0402  [C0402]
C113  4.7u  C-EUC0402  [C0402]
C114  0.1u  C-EUC0402  [C0402]
C115  0.022u  C-EUC0402  [C0402]
C116  0.022u  C-EUC0402  [C0402]
J10  TRM_BLK_1X2  [2POL254]
J11  TRM_BLK_1X2  [2POL254]
J12  TRM_BLK_1X2  [2POL254]
R5  10k  R-US_R0402  [R0402]
R62  280R  R-US_R0402  [R0402]
R63  13.7k  R-US_R0402  [R0402]
R64  3.74k  R-US_R0402  [R0402]
R65  280R  R-US_R0402  [R0402]
R66  13.7k  R-US_R0402  [R0402]
R67  3.74k  R-US_R0402  [R0402]
R68  280R  R-US_R0402  [R0402]
R69  13.7k  R-US_R0402  [R0402]
R70  3.74k  R-US_R0402  [R0402]
TP13  TESTPOINT  [TP_P76H50]
TP18  TESTPOINT  [TP_P76H50]
TP19  TESTPOINT  [TP_P76H50]
TP20  TESTPOINT  [TP_P76H50]
U27  ADS7841E_2K5  [DBQ16]
U30  TLV9051IDCKR  [SC70-5P65_210X110L36X22N_TLV9051]
U31  TLV9051IDCKR  [SC70-5P65_210X110L36X22N_TLV9051]
U32  TLV9051IDCKR  [SC70-5P65_210X110L36X22N_TLV9051]

### Nets
!CS!_SUN_Y+: U27.15(!CS) ; also sheet 2
+3V3: C89.1 C90.1 C91.1 C92.1 C93.1 C94.1 C96.1 C97.1 C99.1 C112.1 C113.1 C114.1 R5.2 R63.2 R66.2 R69.2 U27.1(VCC+_2) U27.8(VREF) U27.9(VCC+) U30.5(V+) U31.5(V+) U32.5(V+) ; also sheet 1,2,3,4,6,7,8
GND: C89.2 C90.2 C91.2 C92.2 C93.2 C94.2 C95.2 C96.2 C97.2 C99.2 C112.2 C113.2 C114.2 J10.1 J11.1 J12.1 R62.1 R65.1 R68.1 U27.6(COM) U27.10(GND) U27.11(MODE) U30.2(V-) U31.2(V-) U32.2(V-) ; also sheet 1,2,3,4,6,7,8
N$3: TP13.1(TP) U27.2(CH0)
N$25: C95.1 R5.1 U27.7(!SHDN)
N$37: C98.1 J12.2 R64.1 U30.3(-)
N$61: R62.2 R63.1 U30.1(+)
N$63: C115.1 J11.2 R67.1 U31.3(-)
N$64: R65.2 R66.1 U31.1(+)
N$65: C116.1 J10.2 R70.1 U32.3(-)
N$66: R68.2 R69.1 U32.1(+)
UCB0_SPI_CLK: U27.16(DCLK) ; also sheet 1,2,3,4,6,7
UCB0_SPI_MISO: U27.12(DOUT) ; also sheet 1,2,3,4,6,7
UCB0_SPI_MOSI: U27.14(DIN) ; also sheet 1,2,3,4,6,7
Y+_0_DEGREES: C98.2 R64.2 TP18.1(TP) U27.3(CH1) U30.4(OUT)
Y+_120_DEGREES: C115.2 R67.2 TP19.1(TP) U27.4(CH2) U31.4(OUT)
Y+_240_DEGREES: C116.2 R70.2 TP20.1(TP) U27.5(CH3) U32.4(OUT)
Unconnected: U27.13(BUSY)

### Notes on the sheet
- A

## Sheet 6 of 8
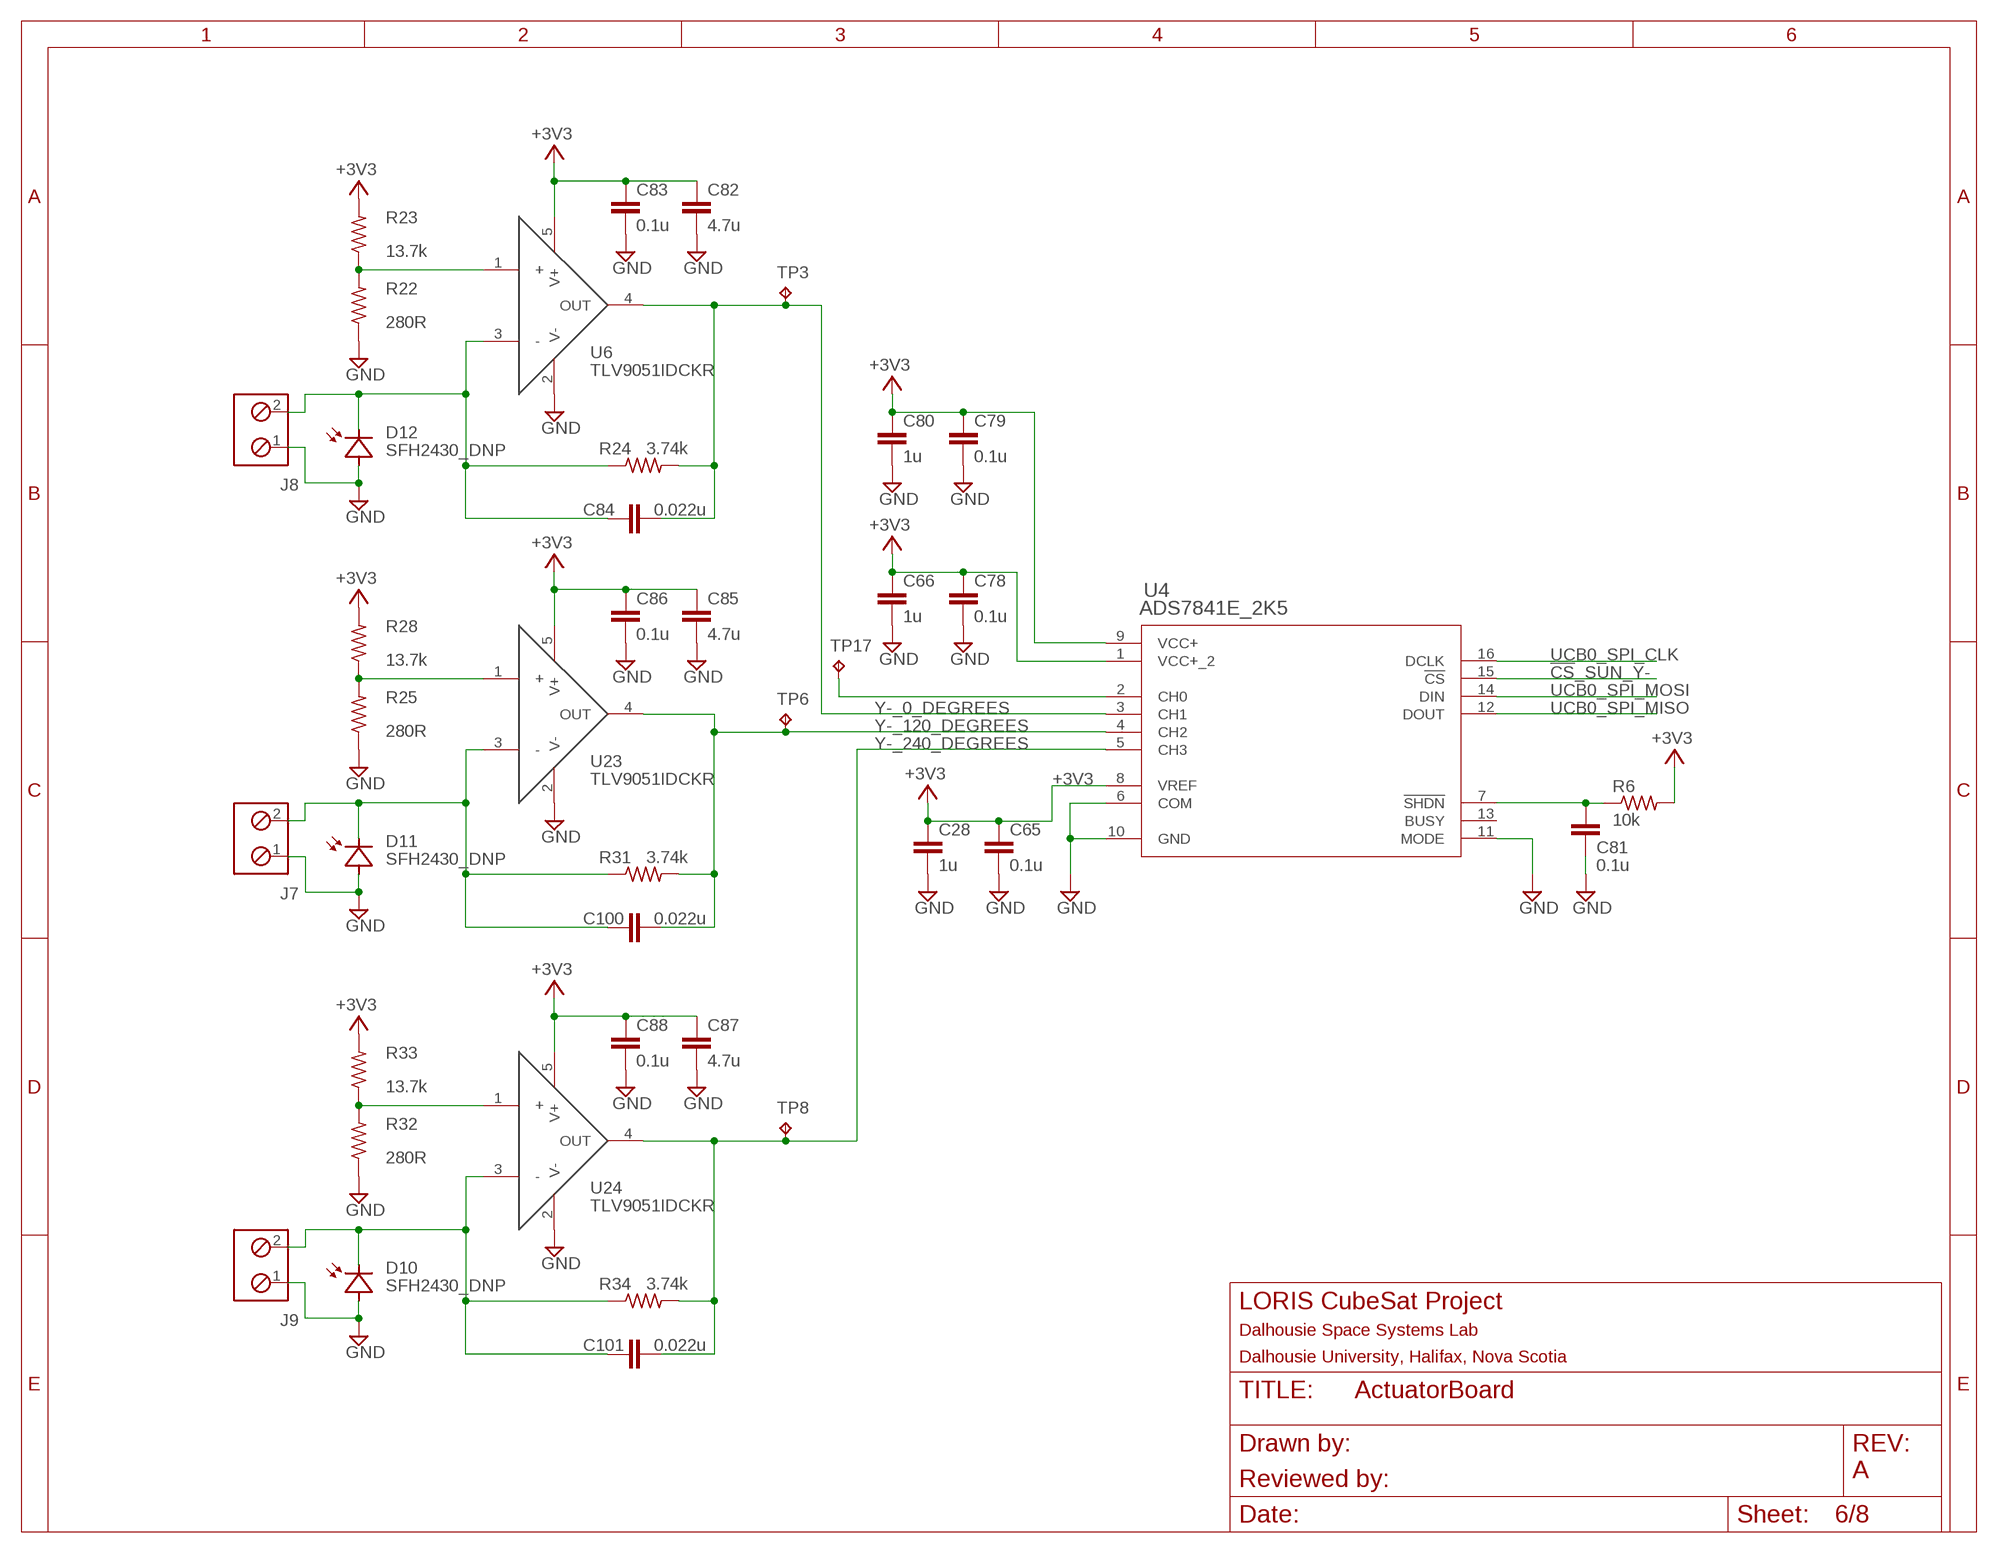
[diagram p5: schematic, sheet 6]

### Parts
C28  1u  C-EUC0402  [C0402]
C65  0.1u  C-EUC0402  [C0402]
C66  1u  C-EUC0402  [C0402]
C78  0.1u  C-EUC0402  [C0402]
C79  0.1u  C-EUC0402  [C0402]
C80  1u  C-EUC0402  [C0402]
C81  0.1u  C-EUC0402  [C0402]
C82  4.7u  C-EUC0402  [C0402]
C83  0.1u  C-EUC0402  [C0402]
C84  0.022u  C-EUC0402  [C0402]
C85  4.7u  C-EUC0402  [C0402]
C86  0.1u  C-EUC0402  [C0402]
C87  4.7u  C-EUC0402  [C0402]
C88  0.1u  C-EUC0402  [C0402]
C100  0.022u  C-EUC0402  [C0402]
C101  0.022u  C-EUC0402  [C0402]
J7  TRM_BLK_1X2  [2POL254]
J8  TRM_BLK_1X2  [2POL254]
J9  TRM_BLK_1X2  [2POL254]
R6  10k  R-US_R0402  [R0402]
R22  280R  R-US_R0402  [R0402]
R23  13.7k  R-US_R0402  [R0402]
R24  3.74k  R-US_R0402  [R0402]
R25  280R  R-US_R0402  [R0402]
R28  13.7k  R-US_R0402  [R0402]
R31  3.74k  R-US_R0402  [R0402]
R32  280R  R-US_R0402  [R0402]
R33  13.7k  R-US_R0402  [R0402]
R34  3.74k  R-US_R0402  [R0402]
TP3  TESTPOINT  [TP_P76H50]
TP6  TESTPOINT  [TP_P76H50]
TP8  TESTPOINT  [TP_P76H50]
TP17  TESTPOINT  [TP_P76H50]
U4  ADS7841E_2K5  [DBQ16]
U6  TLV9051IDCKR  [SC70-5P65_210X110L36X22N_TLV9051]
U23  TLV9051IDCKR  [SC70-5P65_210X110L36X22N_TLV9051]
U24  TLV9051IDCKR  [SC70-5P65_210X110L36X22N_TLV9051]

### Nets
!CS!_SUN_Y-: U4.15(!CS) ; also sheet 2
+3V3: C28.1 C65.1 C66.1 C78.1 C79.1 C80.1 C82.1 C83.1 C85.1 C86.1 C87.1 C88.1 R6.2 R23.2 R28.2 R33.2 U4.1(VCC+_2) U4.8(VREF) U4.9(VCC+) U6.5(V+) U23.5(V+) U24.5(V+) ; also sheet 1,2,3,4,5,7,8
GND: C28.2 C65.2 C66.2 C78.2 C79.2 C80.2 C81.2 C82.2 C83.2 C85.2 C86.2 C87.2 C88.2 J7.1 J8.1 J9.1 R22.1 R25.1 R32.1 U4.6(COM) U4.10(GND) U4.11(MODE) U6.2(V-) U23.2(V-) U24.2(V-) ; also sheet 1,2,3,4,5,7,8
N$9: TP17.1(TP) U4.2(CH0)
N$23: C100.1 J7.2 R31.1 U23.3(-)
N$24: C81.1 R6.1 U4.7(!SHDN)
N$29: C84.1 J8.2 R24.1 U6.3(-)
N$31: R22.2 R23.1 U6.1(+)
N$34: R25.2 R28.1 U23.1(+)
N$35: C101.1 J9.2 R34.1 U24.3(-)
N$36: R32.2 R33.1 U24.1(+)
UCB0_SPI_CLK: U4.16(DCLK) ; also sheet 1,2,3,4,5,7
UCB0_SPI_MISO: U4.12(DOUT) ; also sheet 1,2,3,4,5,7
UCB0_SPI_MOSI: U4.14(DIN) ; also sheet 1,2,3,4,5,7
Y-_0_DEGREES: C84.2 R24.2 TP3.1(TP) U4.3(CH1) U6.4(OUT)
Y-_120_DEGREES: C100.2 R31.2 TP6.1(TP) U4.4(CH2) U23.4(OUT)
Y-_240_DEGREES: C101.2 R34.2 TP8.1(TP) U4.5(CH3) U24.4(OUT)
Unconnected: U4.13(BUSY)

### Notes on the sheet
- A

## Sheet 7 of 8
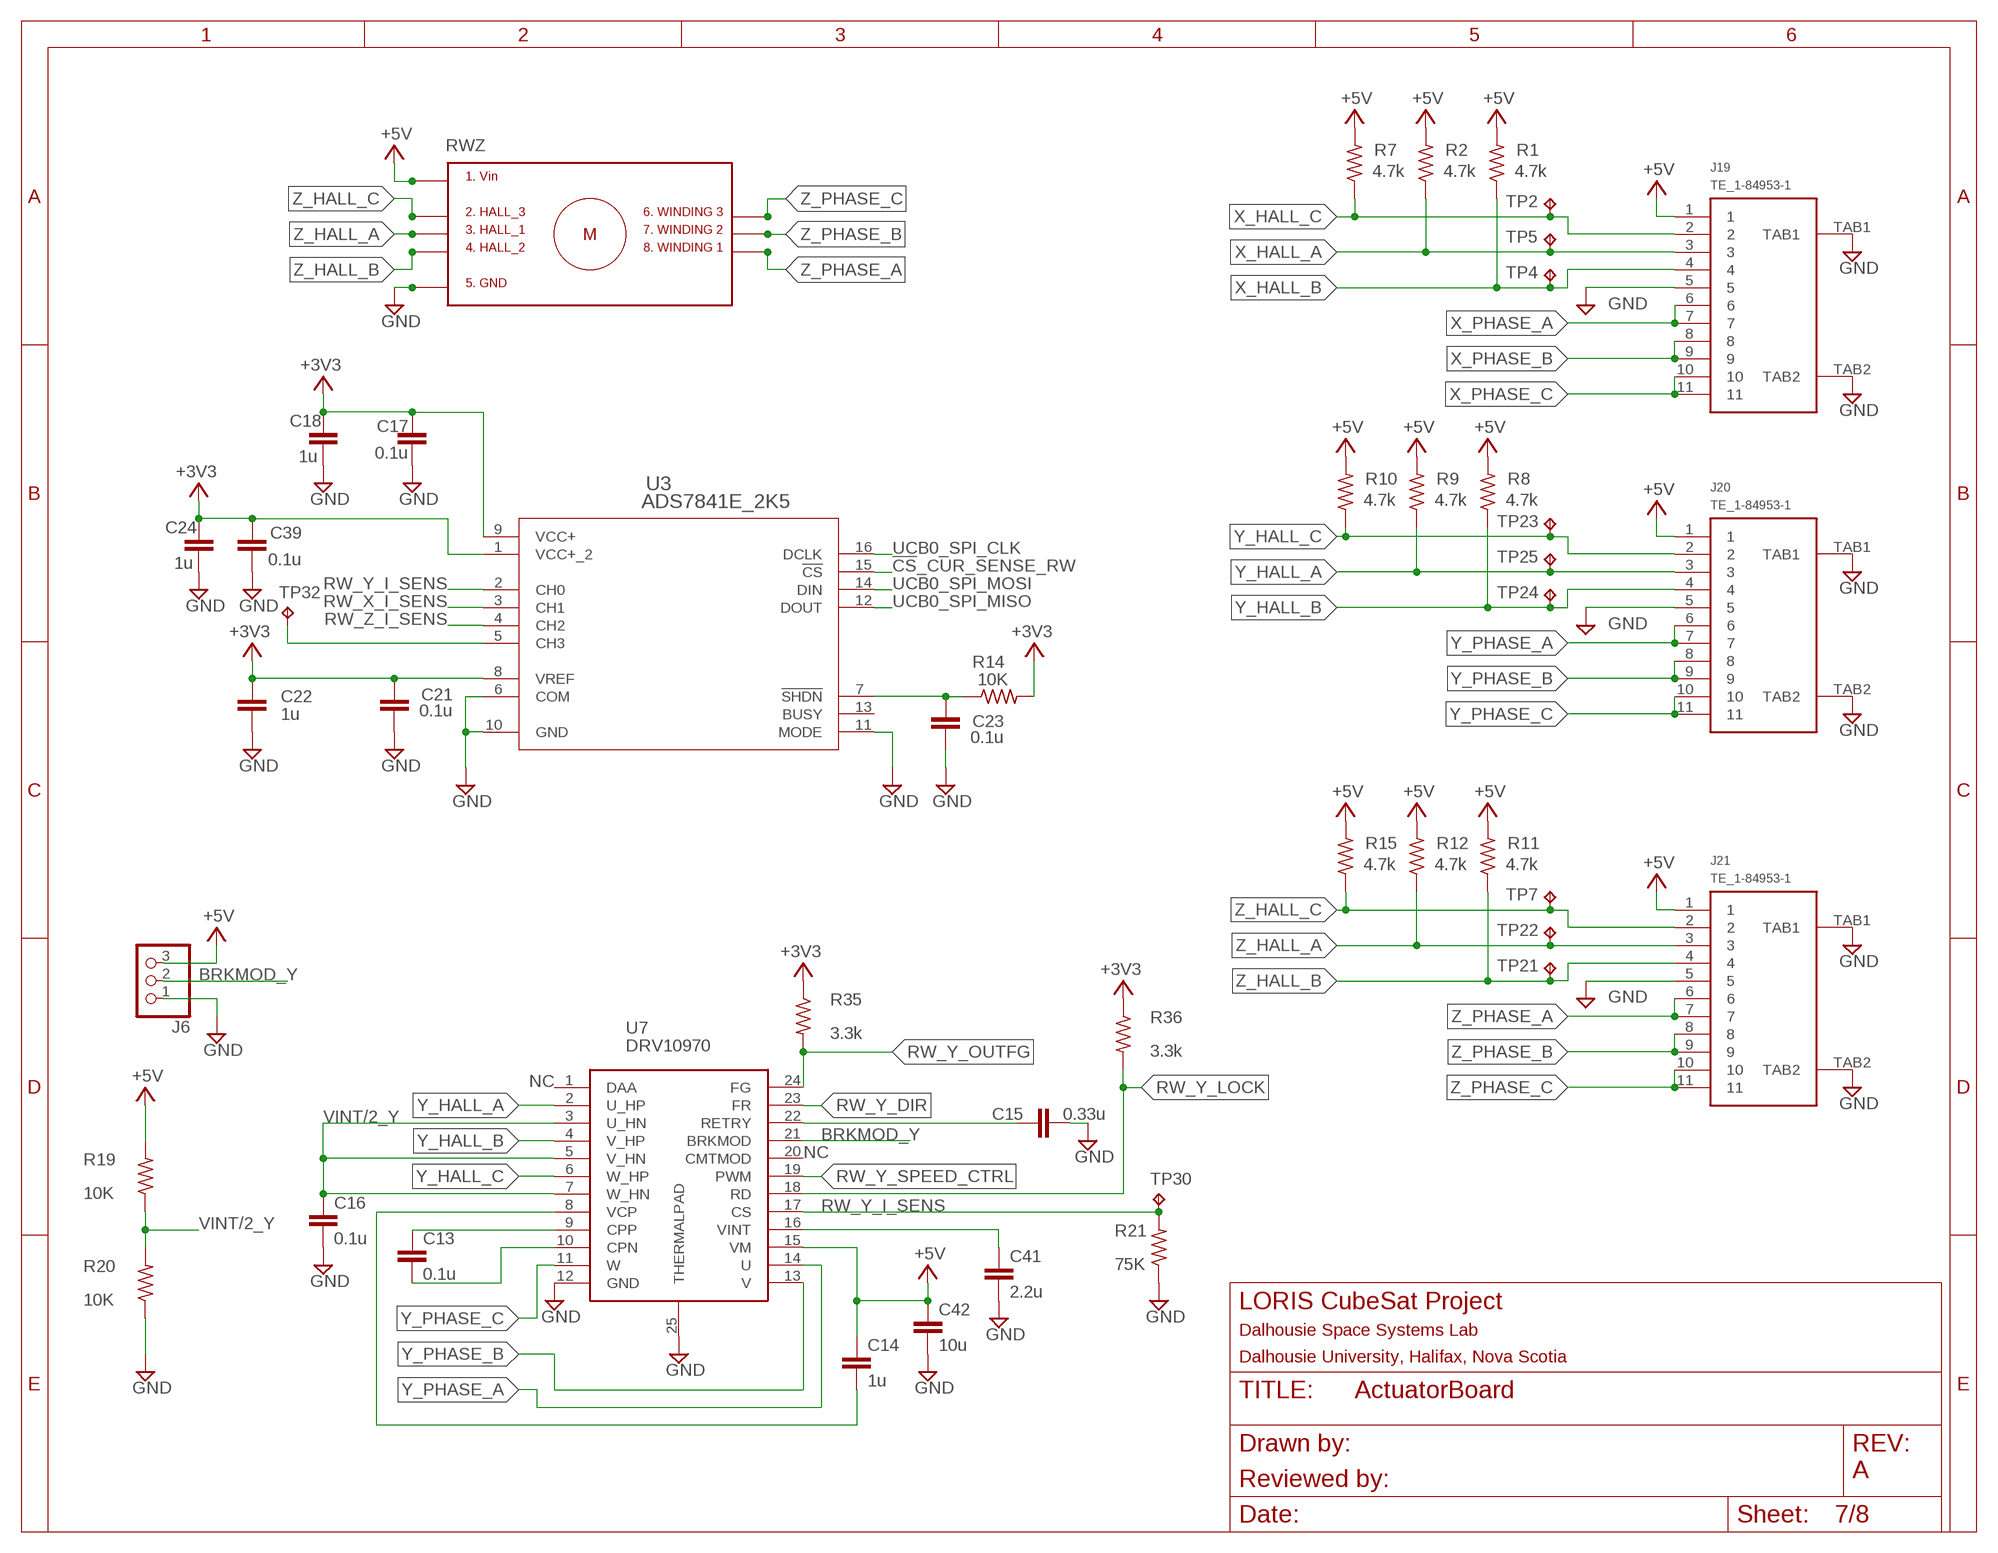
[diagram p6: schematic, sheet 7]

### Parts
C13  0.1u  C-EUC0603  [C0603]
C14  1u  C-EUC0603  [C0603]
C15  0.33u  C-EUC0603  [C0603]
C16  0.1u  C-EUC0603  [C0603]
C17  0.1u  C-EUC0402  [C0402]
C18  1u  C-EUC0402  [C0402]
C21  0.1u  C-EUC0402  [C0402]
C22  1u  C-EUC0402  [C0402]
C23  0.1u  C-EUC0402  [C0402]
C24  1u  C-EUC0402  [C0402]
C39  0.1u  C-EUC0402  [C0402]
C41  2.2u  C-EUC0603  [C0603]
C42  10u  C-EUC0603  [C0603]
J6  PINHD-1X3  [1X03]
J19  TE_1-84953-1  [TE_1-84953-1]
J20  TE_1-84953-1  [TE_1-84953-1]
J21  TE_1-84953-1  [TE_1-84953-1]
R1  4.7k  R-US_R0402  [R0402]
R2  4.7k  R-US_R0402  [R0402]
R7  4.7k  R-US_R0402  [R0402]
R8  4.7k  R-US_R0402  [R0402]
R9  4.7k  R-US_R0402  [R0402]
R10  4.7k  R-US_R0402  [R0402]
R11  4.7k  R-US_R0402  [R0402]
R12  4.7k  R-US_R0402  [R0402]
R14  10K  R-US_R0402  [R0402]
R15  4.7k  R-US_R0402  [R0402]
R19  10K  R-US_R0603  [R0603]
R20  10K  R-US_R0603  [R0603]
R21  75K  R-US_R0603  [R0603]
R35  3.3k  R-US_R0603  [R0603]
R36  3.3k  R-US_R0603  [R0603]
RWZ  REACTION_WHEEL_NOPINS_MAXON  [RWA_NOPINS]
TP2  TESTPOINT  [TP_P76H50]
TP4  TESTPOINT  [TP_P76H50]
TP5  TESTPOINT  [TP_P76H50]
TP7  TESTPOINT  [TP_P76H50]
TP21  TESTPOINT  [TP_P76H50]
TP22  TESTPOINT  [TP_P76H50]
TP23  TESTPOINT  [TP_P76H50]
TP24  TESTPOINT  [TP_P76H50]
TP25  TESTPOINT  [TP_P76H50]
TP30  TESTPOINT  [TP_P76H50]
TP32  TESTPOINT  [TP_P76H50]
U3  ADS7841E_2K5  [DBQ16]
U7  DRV10970_MOTOR_DRIVERDRV10970  [SOP65P640X120-25T240X328N]

### Nets
!CS!_CUR_SENSE_RW: U3.15(!CS) ; also sheet 2
+3V3: C17.1 C18.1 C21.1 C22.1 C24.1 C39.1 R14.2 R35.1 R36.1 U3.1(VCC+_2) U3.8(VREF) U3.9(VCC+) ; also sheet 1,2,3,4,5,6,8
+5V: C14.1 C42.1 J6.3 J19.1 J20.1 J21.1 R1.2 R2.2 R7.2 R8.2 R9.2 R10.2 R11.2 R12.2 R15.2 R19.2 U7.15(VM) ; also sheet 1,2,8
BRKMOD_Y: J6.2 U7.21(BRKMOD)
GND: C15.2 C16.2 C17.2 C18.2 C21.2 C22.2 C23.2 C24.2 C39.2 C41.2 C42.2 J6.1 J19.5 J19.TAB1 J19.TAB2 J20.5 J20.TAB1 J20.TAB2 J21.5 J21.TAB1 J21.TAB2 R20.1 R21.1 U3.6(COM) U3.10(GND) U3.11(MODE) U7.12(GND) U7.25(THERMALPAD) ; also sheet 1,2,3,4,5,6,8
N$11: C23.1 R14.1 U3.7(!SHDN)
N$12: TP32.1(TP) U3.5(CH3)
N$62: C13.1 U7.9(CPP)
N$69: C14.2 U7.8(VCP)
N$70: C13.2 U7.10(CPN)
N$71: C41.1 U7.16(VINT)
N$72: C15.1 U7.22(RETRY)
RW_X_I_SENS: U3.3(CH1) ; also sheet 8
RW_Y_DIR: U7.23(FR) ; also sheet 2
RW_Y_I_SENS: R21.2 TP30.1(TP) U3.2(CH0) U7.17(CS)
RW_Y_LOCK: R36.2 U7.18(RD)
RW_Y_OUTFG: R35.2 U7.24(FG) ; also sheet 2
RW_Y_SPEED_CTRL: U7.19(PWM) ; also sheet 2
RW_Z_I_SENS: U3.4(CH2) ; also sheet 8
UCB0_SPI_CLK: U3.16(DCLK) ; also sheet 1,2,3,4,5,6
UCB0_SPI_MISO: U3.12(DOUT) ; also sheet 1,2,3,4,5,6
UCB0_SPI_MOSI: U3.14(DIN) ; also sheet 1,2,3,4,5,6
VINT/2_Y: C16.1 R19.1 R20.2 U7.3(U_HN) U7.5(V_HN) U7.7(W_HN)
X_HALL_A: J19.3 R2.1 TP5.1(TP) ; also sheet 8
X_HALL_B: J19.4 R1.1 TP4.1(TP) ; also sheet 8
X_HALL_C: J19.2 R7.1 TP2.1(TP) ; also sheet 8
X_PHASE_A: J19.6 J19.7 ; also sheet 8
X_PHASE_B: J19.8 J19.9 ; also sheet 8
X_PHASE_C: J19.10 J19.11 ; also sheet 8
Y_HALL_A: J20.3 R9.1 TP25.1(TP) U7.2(U_HP)
Y_HALL_B: J20.4 R8.1 TP24.1(TP) U7.4(V_HP)
Y_HALL_C: J20.2 R10.1 TP23.1(TP) U7.6(W_HP)
Y_PHASE_A: J20.6 J20.7 U7.14(U)
Y_PHASE_B: J20.8 J20.9 U7.13(V)
Y_PHASE_C: J20.10 J20.11 U7.11(W)
Z_HALL_A: J21.3 R12.1 TP22.1(TP) ; also sheet 8
Z_HALL_B: J21.4 R11.1 TP21.1(TP) ; also sheet 8
Z_HALL_C: J21.2 R15.1 TP7.1(TP) ; also sheet 8
Z_PHASE_A: J21.6 J21.7 ; also sheet 8
Z_PHASE_B: J21.8 J21.9 ; also sheet 8
Z_PHASE_C: J21.10 J21.11 ; also sheet 8
Unconnected: U3.13(BUSY) U7.1(DAA) U7.20(CMTMOD)

### Notes on the sheet
- NC
- NC
- A

## Sheet 8 of 8
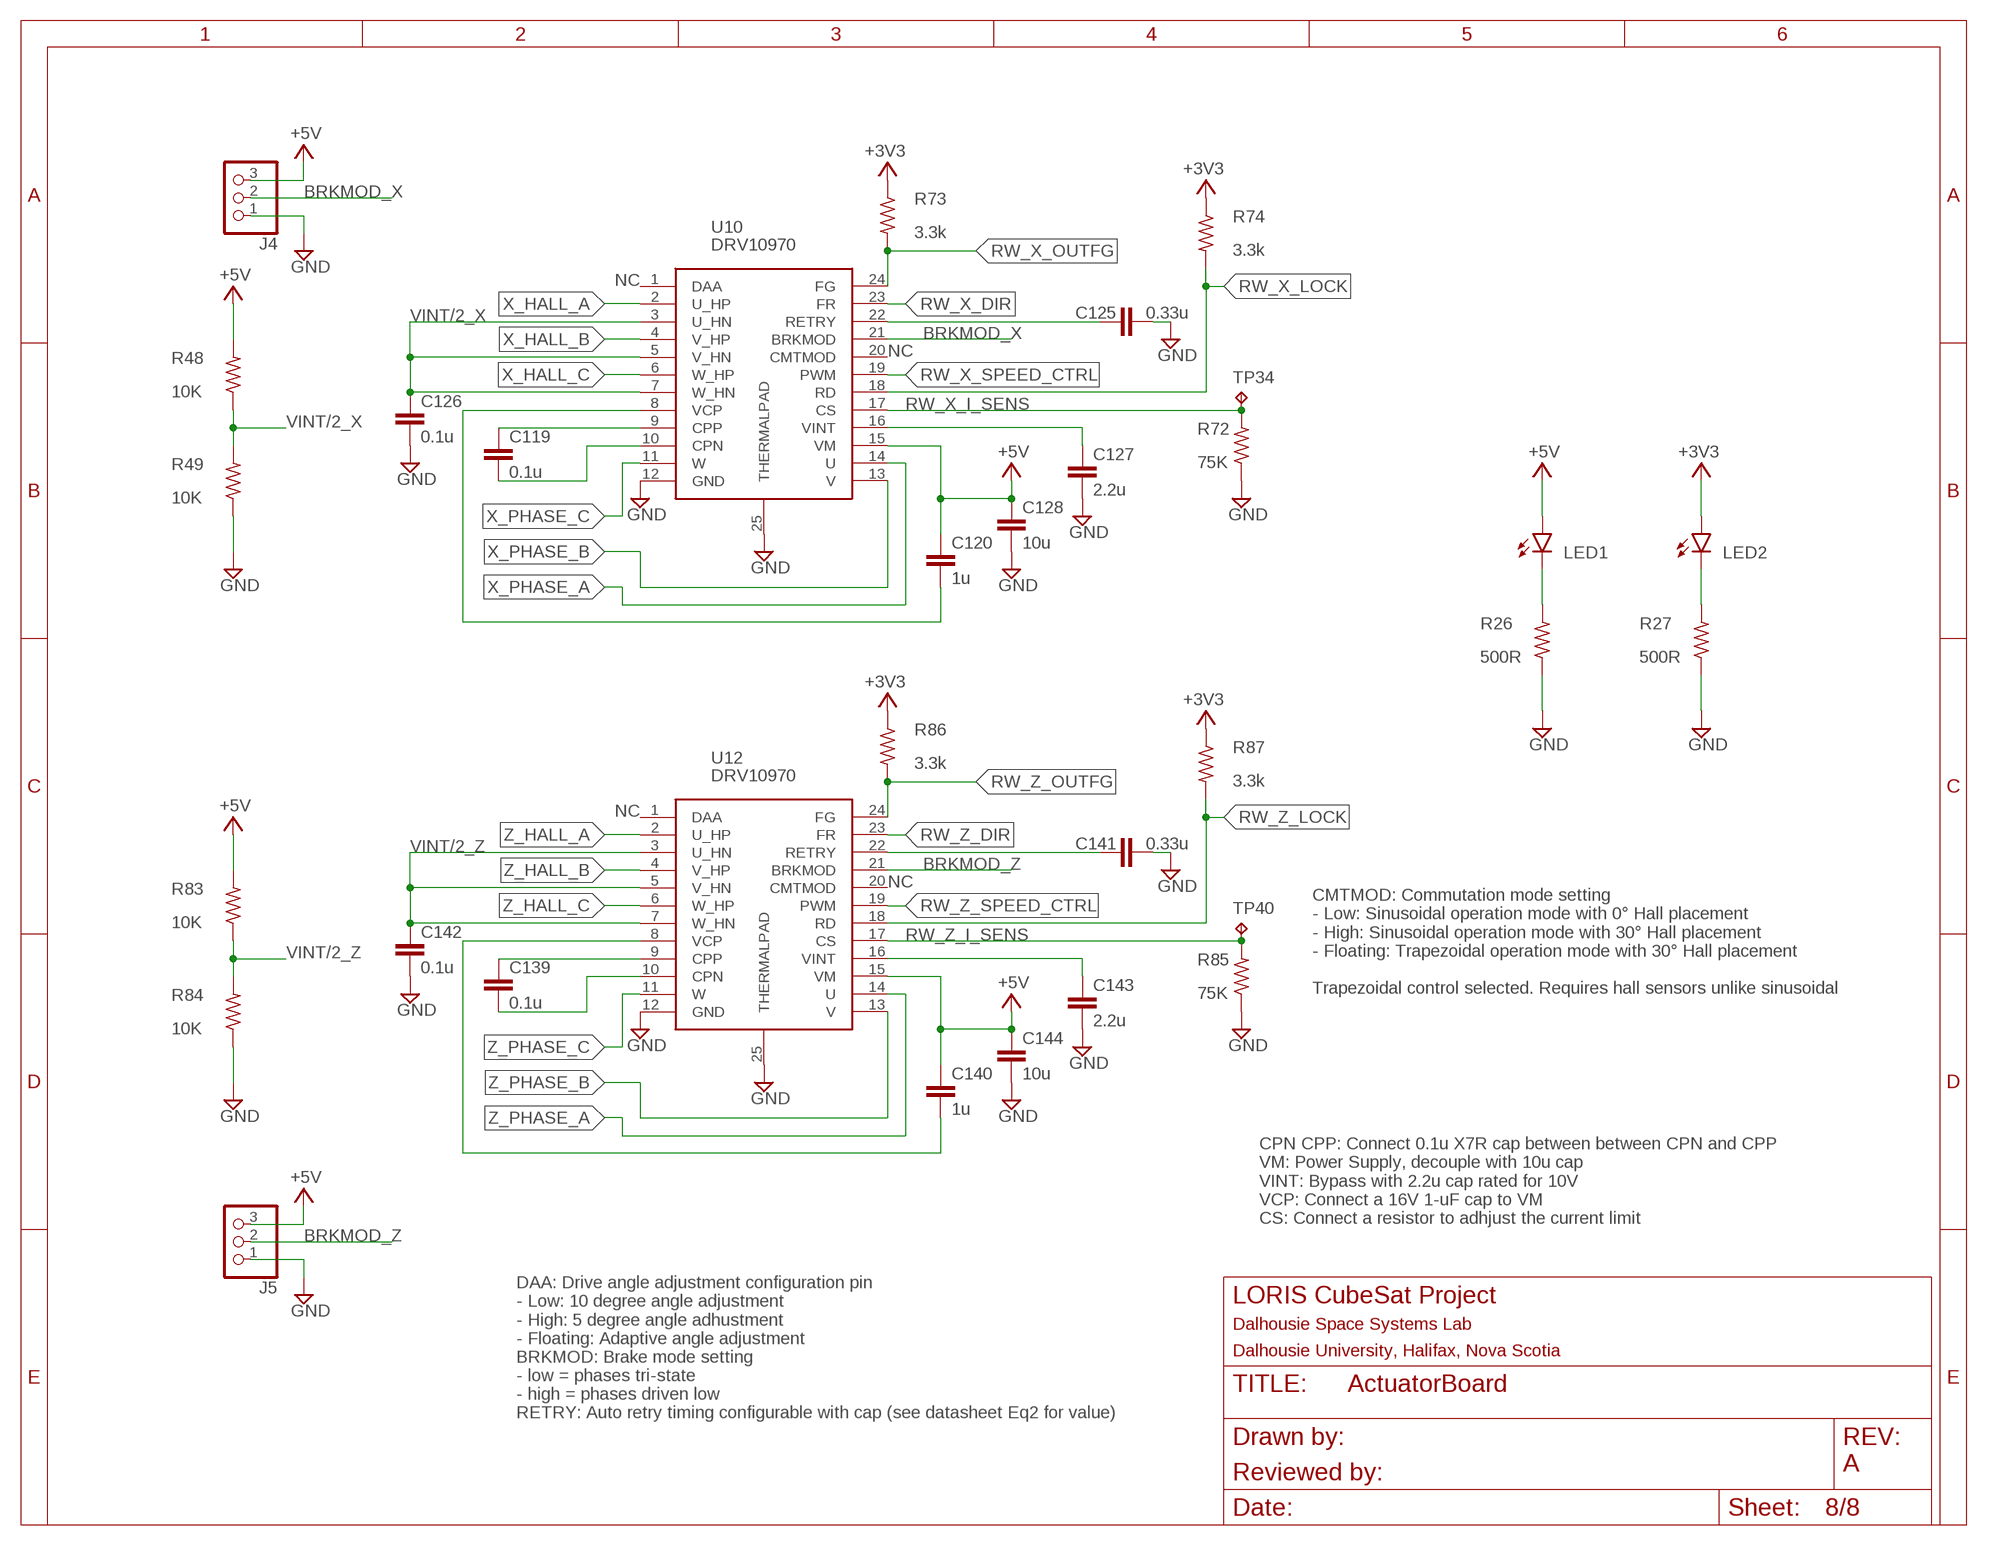
[diagram p7: schematic, sheet 8]

### Parts
C119  0.1u  C-EUC0603  [C0603]
C120  1u  C-EUC0603  [C0603]
C125  0.33u  C-EUC0603  [C0603]
C126  0.1u  C-EUC0603  [C0603]
C127  2.2u  C-EUC0603  [C0603]
C128  10u  C-EUC0603  [C0603]
C139  0.1u  C-EUC0603  [C0603]
C140  1u  C-EUC0603  [C0603]
C141  0.33u  C-EUC0603  [C0603]
C142  0.1u  C-EUC0603  [C0603]
C143  2.2u  C-EUC0603  [C0603]
C144  10u  C-EUC0603  [C0603]
J4  PINHD-1X3  [1X03]
J5  PINHD-1X3  [1X03]
LED1  LEDCHIPLED_0603  [CHIPLED_0603]
LED2  LEDCHIPLED_0603  [CHIPLED_0603]
R26  500R  R-US_R0603  [R0603]
R27  500R  R-US_R0603  [R0603]
R48  10K  R-US_R0603  [R0603]
R49  10K  R-US_R0603  [R0603]
R72  75K  R-US_R0603  [R0603]
R73  3.3k  R-US_R0603  [R0603]
R74  3.3k  R-US_R0603  [R0603]
R83  10K  R-US_R0603  [R0603]
R84  10K  R-US_R0603  [R0603]
R85  75K  R-US_R0603  [R0603]
R86  3.3k  R-US_R0603  [R0603]
R87  3.3k  R-US_R0603  [R0603]
TP34  TESTPOINT  [TP_P76H50]
TP40  TESTPOINT  [TP_P76H50]
U10  DRV10970_MOTOR_DRIVERDRV10970  [SOP65P640X120-25T240X328N]
U12  DRV10970_MOTOR_DRIVERDRV10970  [SOP65P640X120-25T240X328N]

### Nets
+3V3: LED2.A R73.1 R74.1 R86.1 R87.1 ; also sheet 1,2,3,4,5,6,7
+5V: C120.1 C128.1 C140.1 C144.1 J4.3 J5.3 LED1.A R48.2 R83.2 U10.15(VM) U12.15(VM) ; also sheet 1,2,7
BRKMOD_X: J4.2 U10.21(BRKMOD)
BRKMOD_Z: J5.2 U12.21(BRKMOD)
GND: C125.2 C126.2 C127.2 C128.2 C141.2 C142.2 C143.2 C144.2 J4.1 J5.1 R26.1 R27.1 R49.1 R72.1 R84.1 R85.1 U10.12(GND) U10.25(THERMALPAD) U12.12(GND) U12.25(THERMALPAD) ; also sheet 1,2,3,4,5,6,7
N$5: LED1.C R26.2
N$14: LED2.C R27.2
N$87: C119.1 U10.9(CPP)
N$88: C120.2 U10.8(VCP)
N$89: C119.2 U10.10(CPN)
N$90: C127.1 U10.16(VINT)
N$91: C125.1 U10.22(RETRY)
N$105: C139.1 U12.9(CPP)
N$106: C140.2 U12.8(VCP)
N$107: C139.2 U12.10(CPN)
N$108: C143.1 U12.16(VINT)
N$109: C141.1 U12.22(RETRY)
RW_X_DIR: U10.23(FR) ; also sheet 2
RW_X_I_SENS: R72.2 TP34.1(TP) U10.17(CS) ; also sheet 7
RW_X_LOCK: R74.2 U10.18(RD)
RW_X_OUTFG: R73.2 U10.24(FG) ; also sheet 2
RW_X_SPEED_CTRL: U10.19(PWM) ; also sheet 2
RW_Z_DIR: U12.23(FR) ; also sheet 2
RW_Z_I_SENS: R85.2 TP40.1(TP) U12.17(CS) ; also sheet 7
RW_Z_LOCK: R87.2 U12.18(RD)
RW_Z_OUTFG: R86.2 U12.24(FG) ; also sheet 2
RW_Z_SPEED_CTRL: U12.19(PWM) ; also sheet 2
VINT/2_X: C126.1 R48.1 R49.2 U10.3(U_HN) U10.5(V_HN) U10.7(W_HN)
VINT/2_Z: C142.1 R83.1 R84.2 U12.3(U_HN) U12.5(V_HN) U12.7(W_HN)
X_HALL_A: U10.2(U_HP) ; also sheet 7
X_HALL_B: U10.4(V_HP) ; also sheet 7
X_HALL_C: U10.6(W_HP) ; also sheet 7
X_PHASE_A: U10.14(U) ; also sheet 7
X_PHASE_B: U10.13(V) ; also sheet 7
X_PHASE_C: U10.11(W) ; also sheet 7
Z_HALL_A: U12.2(U_HP) ; also sheet 7
Z_HALL_B: U12.4(V_HP) ; also sheet 7
Z_HALL_C: U12.6(W_HP) ; also sheet 7
Z_PHASE_A: U12.14(U) ; also sheet 7
Z_PHASE_B: U12.13(V) ; also sheet 7
Z_PHASE_C: U12.11(W) ; also sheet 7
Unconnected: U10.1(DAA) U10.20(CMTMOD) U12.1(DAA) U12.20(CMTMOD)

### Notes on the sheet
- NC
- NC
- NC
- NC
- CMTMOD: Commutation mode setting
  - Low: Sinusoidal operation mode with 0° Hall placement 
  - High: Sinusoidal operation mode with 30° Hall placement 
  - Floating: Trapezoidal operation mode with 30° Hall placement
  
  Trapezoidal control selected. Requires hall sensors unlike sinusoidal
- CPN CPP: Connect 0.1u X7R cap between between CPN and CPP
  VM: Power Supply, decouple with 10u cap
  VINT: Bypass with 2.2u cap rated for 10V
  VCP: Connect a 16V 1-uF cap to VM
  CS: Connect a resistor to adhjust the current limit
- DAA: Drive angle adjustment configuration pin
  - Low: 10 degree angle adjustment
  - High: 5 degree angle adhustment
  - Floating: Adaptive angle adjustment
  BRKMOD: Brake mode setting
  - low = phases tri-state
  - high = phases driven low
  RETRY: Auto retry timing configurable with cap (see datasheet Eq2 for value)
- A

## Library data of the parts
C13-C18 C21-C27 C29 C33 C37 C39-C44 C56 C64 C119-C132 C139-C144 = rcl:C-EU: CAPACITOR, European symbol; SPICEPREFIX: C
C28 C45-C55 C65-C116 = resistor:C-EU: CAPACITOR, European symbol
J1 J4-J6 = my_library:PINHD-1X3: PIN HEADER
J2 J3 = my_library:PINHD-2X8: PIN HEADER
J7-J18 JX JY JZ = my_library:TRM_BLK_1X2: PHOENIX CONNECTOR; OC_FARNELL: unknown; OC_NEWARK: unknown
J19-J21 = my_library:TE_1-84953-1
JP5 JP7 JP9 = my_library:JP1Q: JUMPER
LED1 LED2 = led:LED: LED OSRAM: - CHIPLED LG R971, LG N971, LY N971, LG Q971, LY Q971, LO R971, LY R971 LH N974, LH R974 LS Q976, LO Q976, LY Q976 LO Q996 - Hyper CHIPLED LW Q18S LB Q993, LB Q99A, LB R99A - SideLED LS A670, LO A670, LY A670, LG A670, LP A670 LB A673, LV A673, LT A673, LW A673 LH A674 LY A675 LS A676, LA A676, LO A676, LY A676, LW A676 LS A679, LY A679, LG A679 - Hyper Micro SIDELED® LS Y876, LA Y876, LO Y876, LY Y876 LT Y87S - SmartLED LW L88C, LW L88S LB L89C, LB L89S, LG L890 LS L89K, LO L89K, LY L89K LS L896, LA L896, LO L896, LY L896 - TOPLED LS T670, LO T670, LY T670, LG T670, LP T670 LSG T670, LSP T670, LSY T670, LOP T670, LYG T670 LG T671, LOG T671, LSG T671 LB T673, LV T673, LT T673, LW T673 LH T674 LS T676, LA T676, LO T676, LY T676, LB T676, LH T676, LSB T676, LW T676 LB T67C, LV T67C, LT T67C, LS T67K, LO T67K, LY T67K, LW E67C LS E67B, LA E67B, LO E67B, LY E67B, LB E67C, LV E67C, LT E67C LW T67C LS T679, LY T679, LG T679 LS T770, LO T770, LY T770, LG T770, LP T770 LB T773, LV T773, LT T773, LW T773 LH T774 LS E675, LA E675, LY E675, LS T675 LS T776, LA T776, LO T776, LY T776, LB T776 LHGB T686 LT T68C, LB T68C - Hyper Mini TOPLED® LB M676 - Mini TOPLED Santana® LG M470 LS M47K, LO M47K, LY M47K Source: http://www.osram.convergy.de LUXEON: - LUMILED® LXK2-PW12-R00, LXK2-PW12-S00, LXK2-PW14-U00, LXK2-PW14-V00 LXK2-PM12-R00, LXK2-PM12-S00, LXK2-PM14-U00 LXK2-PE12-Q00, LXK2-PE12-R00, LXK2-PE12-S00, LXK2-PE14-T00, LXK2-PE14-U00 LXK2-PB12-K00, LXK2-PB12-L00, LXK2-PB12-M00, LXK2-PB14-N00, LXK2-PB14-P00, LXK2-PB14-Q00 LXK2-PR12-L00, LXK2-PR12-M00, LXK2-PR14-Q00, LXK2-PR14-R00 LXK2-PD12-Q00, LXK2-PD12-R00, LXK2-PD12-S00 LXK2-PH12-R00, LXK2-PH12-S00 LXK2-PL12-P00, LXK2-PL12-Q00, LXK2-PL12-R00 Source: www.luxeon.com KINGBRIGHT: KA-3528ASYC Source: www.kingbright.com
MH5-MH8 = my_library:MTGP700H400
MX MY = my_library:NCTR-M002_MAGNETORQUER
R1-R21 R26 R27 R29 R30 R35 R36 R48 R49 R71-R77 R83-R87 = rcl:R-US_: RESISTOR, American symbol; SPICEPREFIX: R
R22-R25 R28 R31-R34 R38-R40 R44-R46 R50-R70 = resistor:R-US_: RESISTOR, American symbol
RWZ = my_library:REACTION_WHEEL_NOPINS_MAXON
TP1-TP25 TP30-TP32 TP34-TP38 TP40 TP43-TP46 TP51-TP54 = my_library:TESTPOINT
U1 U5 U8 = my_library:TVS991: TVS991 General Purpose Op-Amp
U2-U4 U13 U25 U27 = my_library:ADS7841E_2K5; DATASHEET_URL: http://www.ti.com/lit/gpn/ADS7841; DESCRIPTION: 12-Bit, 4-Channel Serial Output Sampling Analog-to-Digital Converter; FAMILY_NAME: PRECISION ADC (<=10MSPS); GENERIC_PART_NUMBER: ADS7841; INDUSTRY_STD_PKG_TYPE: SSOP/QSOP; MANUFACTURER: Texas Instruments; PACKAGE_DESIGNATOR: DBQ; PIN_COUNT: 16
U6 U15 U19 U21 U23 U24 U26 U28-U32 = my_library:TLV9051
U7 U10 U12 = my_library:DRV10970_MOTOR_DRIVER
U9 U35 U39 = my_library:BD6210F-E2